# Altium project RK3399_SOM_BOARD.PrjPcb (part 3 of 4)

## Sheet USB_TYPEC_Connector.SchDoc
size A3; Date: 07.08.2025; CheckedBy: Own Check; CompanyName: No Company; DocumentNumber: ELK.PCB.0005.0005.A.A; Revision: V0.0.1; SheetNumber: 16; SheetTotal: 22
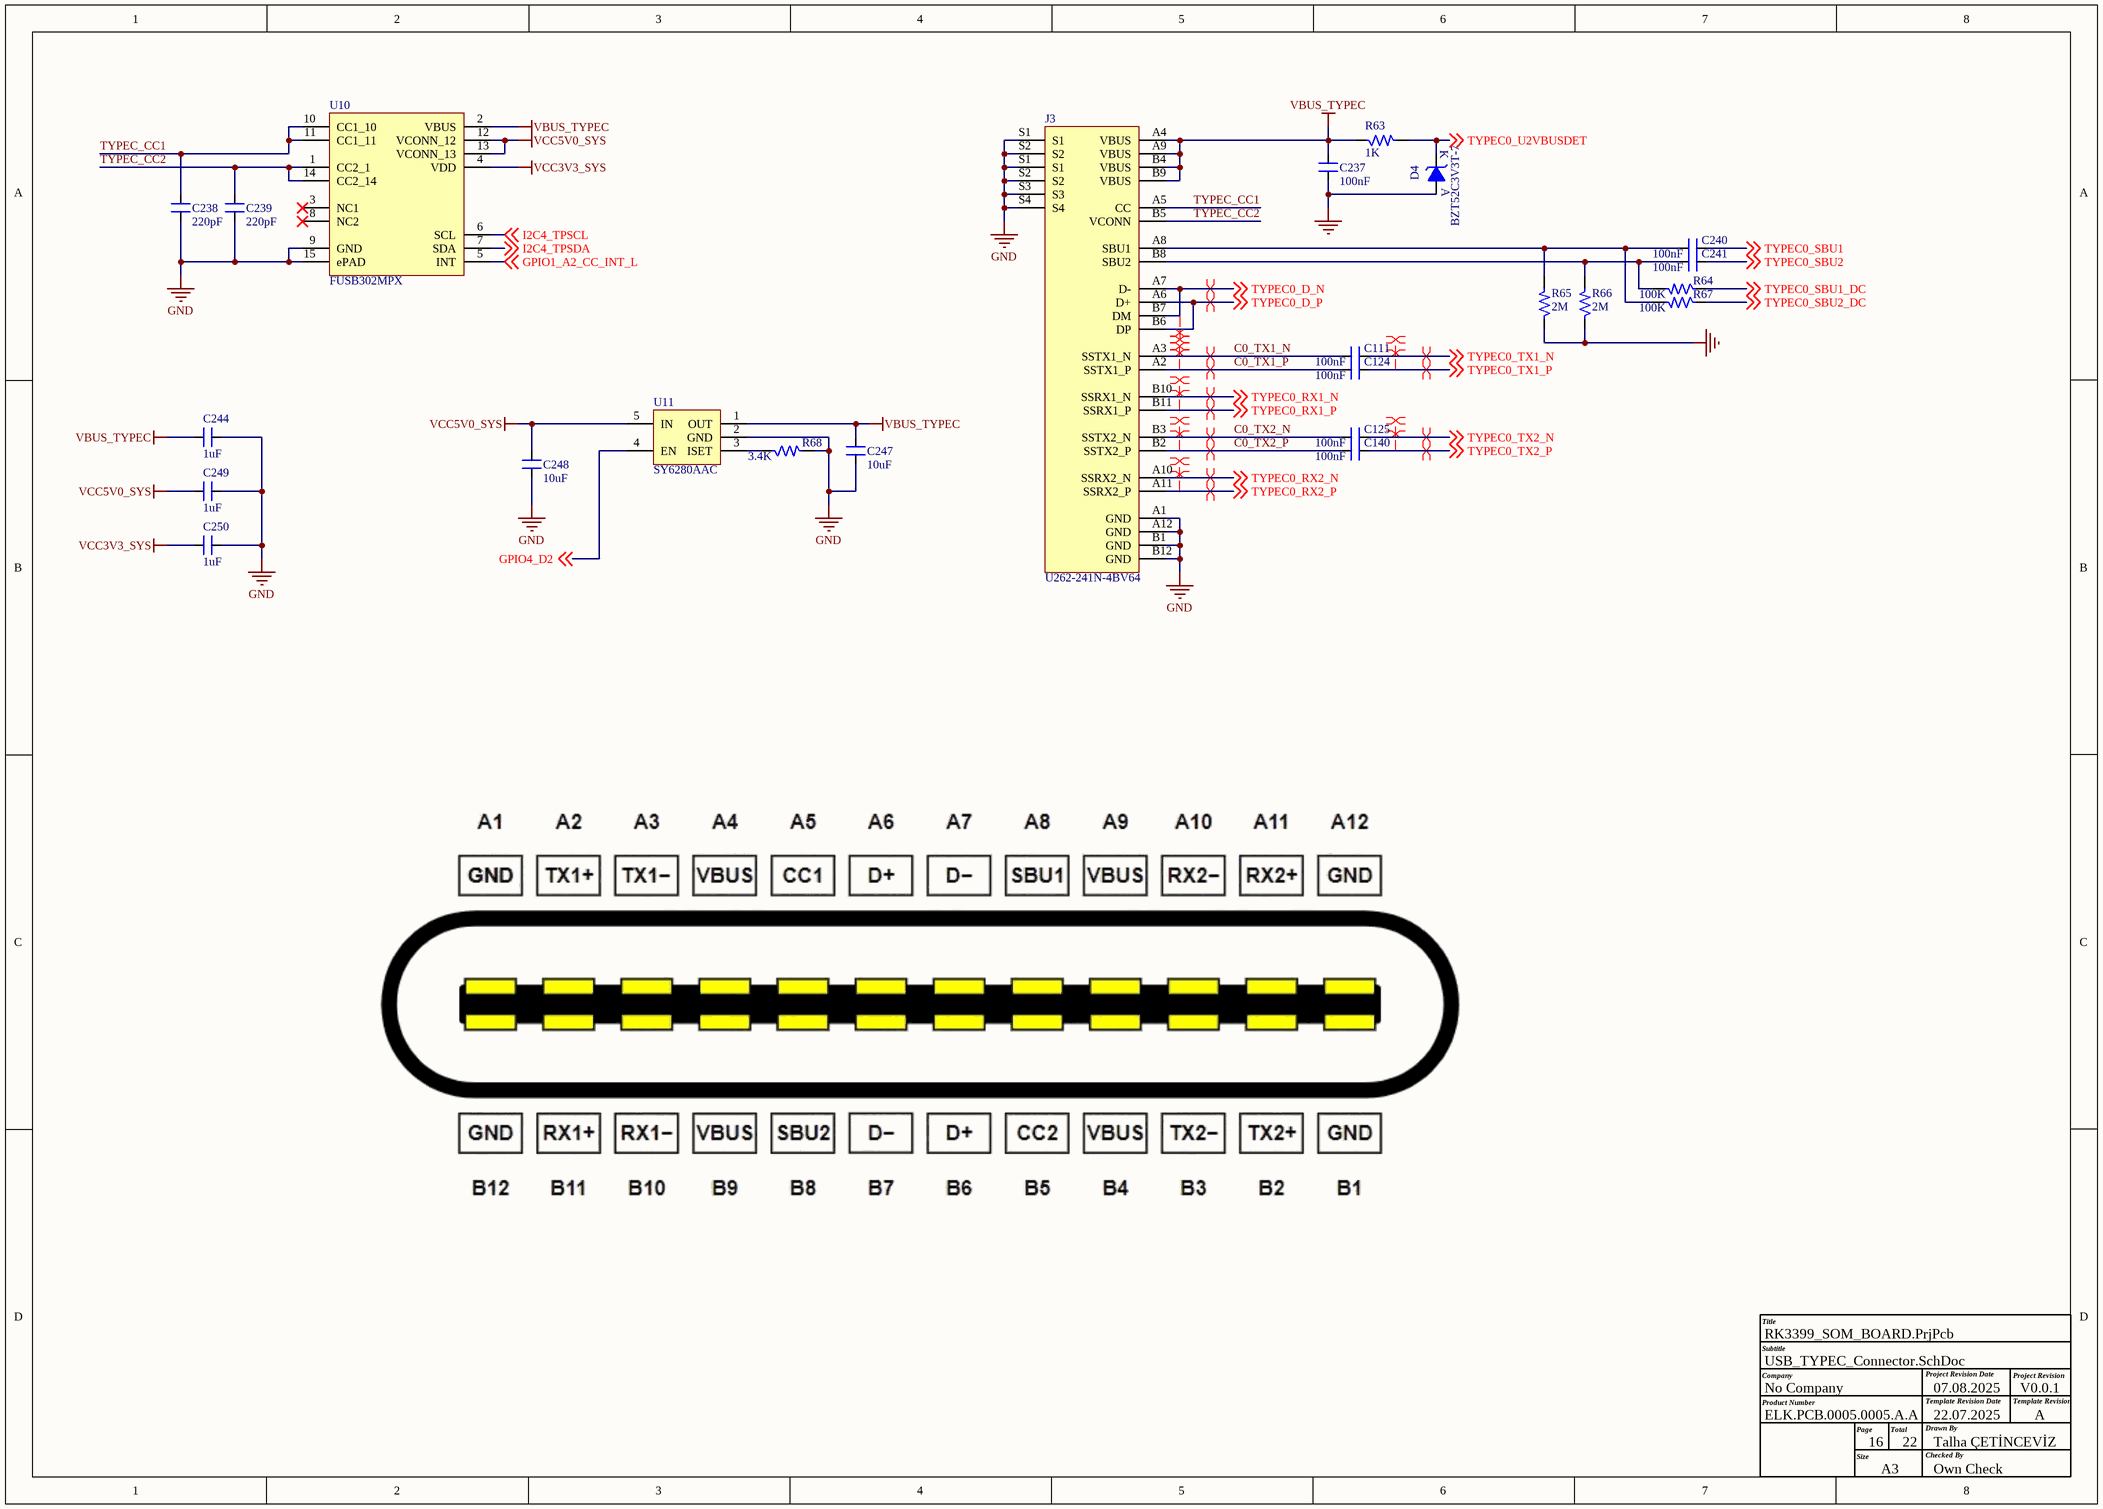
[diagram p14: USB_TYPEC_Connector.SchDoc]

### Parts
(Parts that share a designator on the sheet are numbered #1, #2 ... from top to bottom, then left to right.)
C111#2  100nF  [CAP_0402]
C124#2  100nF  [CAP_0402]
C125#2  100nF  [CAP_0402]
C140#2  100nF  [CAP_0402]
C237  100nF  [CAP_0603]
C238  220pF  [CAP_0402]
C239  220pF  [CAP_0402]
C240  100nF  [CAP_0402]
C241  100nF  [CAP_0402]
C244  1uF  [CAP_0402]
C247  10uF  [CAP_0402]
C248  10uF  [CAP_0402]
C249  1uF  [CAP_0402]
C250  1uF  [CAP_0402]
D4  BZT52C3V3T-7  [DIO_SOD523]
J3  U262-241N-4BV64  [CON24_19.64_U262-241N-4BV64_TH_RA]
R63  1K  [RES_0402]
R64  100K  [RES_0402]
R65  2M  [RES_0402]
R66  2M  [RES_0402]
R67  100K  [RES_0402]
R68  3.4K  [RES_0402]
U10  FUSB302MPX  [MLP-14_98.4X98.4_SMD]
U11  SY6280AAC  [SOT23-5]

### Nets
GND: C237.1 C238.1 C239.1 C244.1 C247.1 C248.1 C249.1 C250.1 D4.A J3.A1(GND) J3.A12(GND) J3.B1(GND) J3.B12(GND) J3.S1 J3.S2 J3.S3 J3.S4 R65.1 R66.1 R68.2 U10.9(GND) U10.15(ePAD) U11.2(GND)
VBUS_TYPEC: C237.2 C244.2 C247.2 J3.A4(VBUS) J3.A9(VBUS) J3.B4(VBUS) J3.B9(VBUS) R63.1 U10.2(VBUS) U11.1(OUT)
VCC3V3_SYS: C250.2 U10.4(VDD)
VCC5V0_SYS: C248.2 C249.2 U10.12(VCONN_12) U10.13(VCONN_13) U11.5(IN)
C0_TX1_N: C111#2.1 J3.A3(SSTX1_N)
C0_TX1_P: C124#2.1 J3.A2(SSTX1_P)
C0_TX2_N: C125#2.1 J3.B3(SSTX2_N)
C0_TX2_P: C140#2.1 J3.B2(SSTX2_P)
GPIO1_A2_CC_INT_L: U10.5(INT) ; off-sheet GPIO1_A2_CC_INT_L
GPIO4_D2: U11.4(EN) ; off-sheet GPIO4_D2
I2C4_TPSCL: U10.6(SCL) ; off-sheet I2C4_TPSCL
I2C4_TPSDA: U10.7(SDA) ; off-sheet I2C4_TPSDA
TYPEC0_D_N: J3.A7(D-) J3.B7(DM) ; off-sheet TYPEC0_D_N
TYPEC0_D_P: J3.A6(D+) J3.B6(DP) ; off-sheet TYPEC0_D_P
TYPEC0_RX1_N: J3.B10(SSRX1_N) ; off-sheet TYPEC0_RX1_N
TYPEC0_RX1_P: J3.B11(SSRX1_P) ; off-sheet TYPEC0_RX1_P
TYPEC0_RX2_N: J3.A10(SSRX2_N) ; off-sheet TYPEC0_RX2_N
TYPEC0_RX2_P: J3.A11(SSRX2_P) ; off-sheet TYPEC0_RX2_P
TYPEC0_SBU1: C240.2 ; off-sheet TYPEC0_SBU1
TYPEC0_SBU1_DC: R64.1 ; off-sheet TYPEC0_SBU1_DC
TYPEC0_SBU2: C241.2 ; off-sheet TYPEC0_SBU2
TYPEC0_SBU2_DC: R67.1 ; off-sheet TYPEC0_SBU2_DC
TYPEC0_TX1_N: C111#2.2 ; off-sheet TYPEC0_TX1_N
TYPEC0_TX1_P: C124#2.2 ; off-sheet TYPEC0_TX1_P
TYPEC0_TX2_N: C125#2.2 ; off-sheet TYPEC0_TX2_N
TYPEC0_TX2_P: C140#2.2 ; off-sheet TYPEC0_TX2_P
TYPEC0_U2VBUSDET: D4.K R63.2 ; off-sheet TYPEC0_U2VBUSDET
TYPEC_CC1: C238.2 J3.A5(CC) U10.10(CC1_10) U10.11(CC1_11)
TYPEC_CC2: C239.2 J3.B5(VCONN) U10.1(CC2_1) U10.14(CC2_14)
NetC240_1: C240.1 J3.A8(SBU1) R65.2 R67.2
NetC241_1: C241.1 J3.B8(SBU2) R64.2 R66.2
NetR68_1: R68.1 U11.3(ISET)

Not connected (* = marked no-connect by the designer): U10 3(NC1)* 8(NC2)*

### Layout directives
differential pair; differential pair class DIFF90_USBTYPEC: C0_TX1_N, C0_TX1_P, C0_TX2_N, C0_TX2_P, TYPEC0_D_N, TYPEC0_D_P, TYPEC0_RX1_N, TYPEC0_RX1_P, TYPEC0_RX2_N, TYPEC0_RX2_P, TYPEC0_TX1_N, TYPEC0_TX1_P, TYPEC0_TX2_N, TYPEC0_TX2_P
net class TYPEC0 SIG. GROUP; net class DIFF_PAIR_CLASS: C0_TX1_N, C0_TX1_P, C0_TX2_N, C0_TX2_P, TYPEC0_D_N, TYPEC0_D_P, TYPEC0_RX1_N, TYPEC0_RX1_P, TYPEC0_RX2_N, TYPEC0_RX2_P, TYPEC0_TX1_N, TYPEC0_TX1_P, TYPEC0_TX2_N, TYPEC0_TX2_P

### Notes on the sheet
- Title
- Company
- Product Number
- Subtitle
- Project Revision Date
- Template Revision Date
- Project Revision
- Template Revision
- Size
- Page
- A3
- Total
- Checked By
- Drawn By
- 22.07.2025
- Talha ÇETİNCEVİZ
- A

### Library data of the parts
C111#2 C124#2 C125#2 C140#2 C240 C241 = CAP_100nF-25V-10%-0402: 0.1µF ±10% 25V Ceramic Capacitor X7R 0402 (1005 Metric); Manufacturer: Walsin Technology Corporation; Manufacturer Part Number: 0402B104K250CT; Case/Package: 0402; Supplier-1: Digikey
C237 = CAP_100nF-10V-5%-0603: 0.1µF ±10% 10V Ceramic Capacitor X7R 0603 (1608 Metric); Manufacturer: Yageo; Manufacturer Part Number: CC0603KRX7R6BB104; Case/Package: 0603; Supplier-1: Digikey
C238 C239 = CAP_220pF-10V-10%-0402: 220pF ±10% 10V Ceramic Capacitor X7R 0402 (1005 Metric); Manufacturer: KEMET; Manufacturer Part Number: C0402C221K8RAC7867; Case/Package: 0402; Supplier-1: Digikey
C244 C249 C250 = CAP_1uF-10V-10%-0402: 1µF ±10% 10V Ceramic Capacitor X6S 0402 (1005 Metric); Manufacturer: Murata Electronics; Manufacturer Part Number: GRT155C81A105KE01D; Case/Package: 0402; Supplier-1: Digikey
C247 C248 = CAP_10uF-10V-20%-0402: 10µF ±20% 10V Ceramic Capacitor X5R 0402 (1005 Metric); Manufacturer Part Number: CL05A106MP5NUNC; Manufacturer: Samsung Electro-Mechanics; Case/Package: 0402; Supplier-1: Digikey
D4 = DIO-Z_3.3V-300mW-SOD-523: Zener Diode 3.3V 300mW ±6% Surface Mount SOD-523; Manufacturer: Diodes Incorporated; Manufacturer Part Number: BZT52C3V3T-7; Case/Package: SOD523; Supplier-1: Digikey
J3 = CON-TYPEC_U262-241N-4BV64-SMD: USB - Type C Female 24 SMD USB Connectors RoHS; Manufacturer: XKB Connectivity; Manufacturer Part Number: U262-241N-4BV64; Case/Package: SMD; Supplier-1: LCSC
R63 = RES_1K-0.1W-1%-0402: 1 kOhms ±1% 0.1W, 1/10W Chip Resistor 0402 (1005 Metric) Anti-Sulfur Thin Film; Manufacturer: Vishay Beyschlag/Draloric/BC Components; Manufacturer Part Number: MCS04020C1001FE000; Case/Package: 0402; Supplier-1: Digikey
R64 R67 = RES_100K-0.1W-1%-0402: 100 kOhms ±1% 0.1W, 1/10W Chip Resistor 0402 (1005 Metric) Anti-Sulfur Thin Film; Manufacturer: Vishay Beyschlag/Draloric/BC Components; Manufacturer Part Number: MCS04020C1003FE000; Case/Package: 0402; Supplier-1: Digikey
R65 R66 = RES_2M-0.1W-1%-0402: 2 MOhms ±1% 0.1W, 1/10W Chip Resistor 0402 (1005 Metric) Anti-Sulfur Thin Film; Manufacturer: Vishay Beyschlag/Draloric/BC Components; Manufacturer Part Number: MCS04020C2004FE000; Case/Package: 0402; Supplier-1: Digikey
R68 = RES_3.4K-0.1W-1%-0402: 3.4 kOhms ±1% 0.1W, 1/10W Chip Resistor 0402 (1005 Metric) Automotive AEC-Q200 Thick Film; Manufacturer: Panasonic Electronic Components; Manufacturer Part Number: ERJ-2RKF3401X; Case/Package: 0402; Supplier-1: Digikey
U10 = IC_FUSB302MPX: USB Controller USB 3.1 USB Interface 14-MLP (2.5x2.5); Manufacturer: ON Semiconductor; Manufacturer Part Number: FUSB302MPX; Case/Package: 14-MLP; Supplier-1: Digikey
U11 = REG-ADJ_5.5V-5.5V-1.25A-SOT-23-5: SOT-23-5 PMIC - Power Distribution Switches RoHS; Manufacturer: Silergy Corp; Manufacturer Part Number: SY6280AAC; Case/Package: SOT-23-5; Supplier-1: LCSC

## Sheet RGMII_PHY.SchDoc
size A4; Date: 07.08.2025; CheckedBy: Own Check; CompanyName: No Company; DocumentNumber: ELK.PCB.0005.0005.A.A; Revision: V0.0.1; SheetNumber: 17; SheetTotal: 22
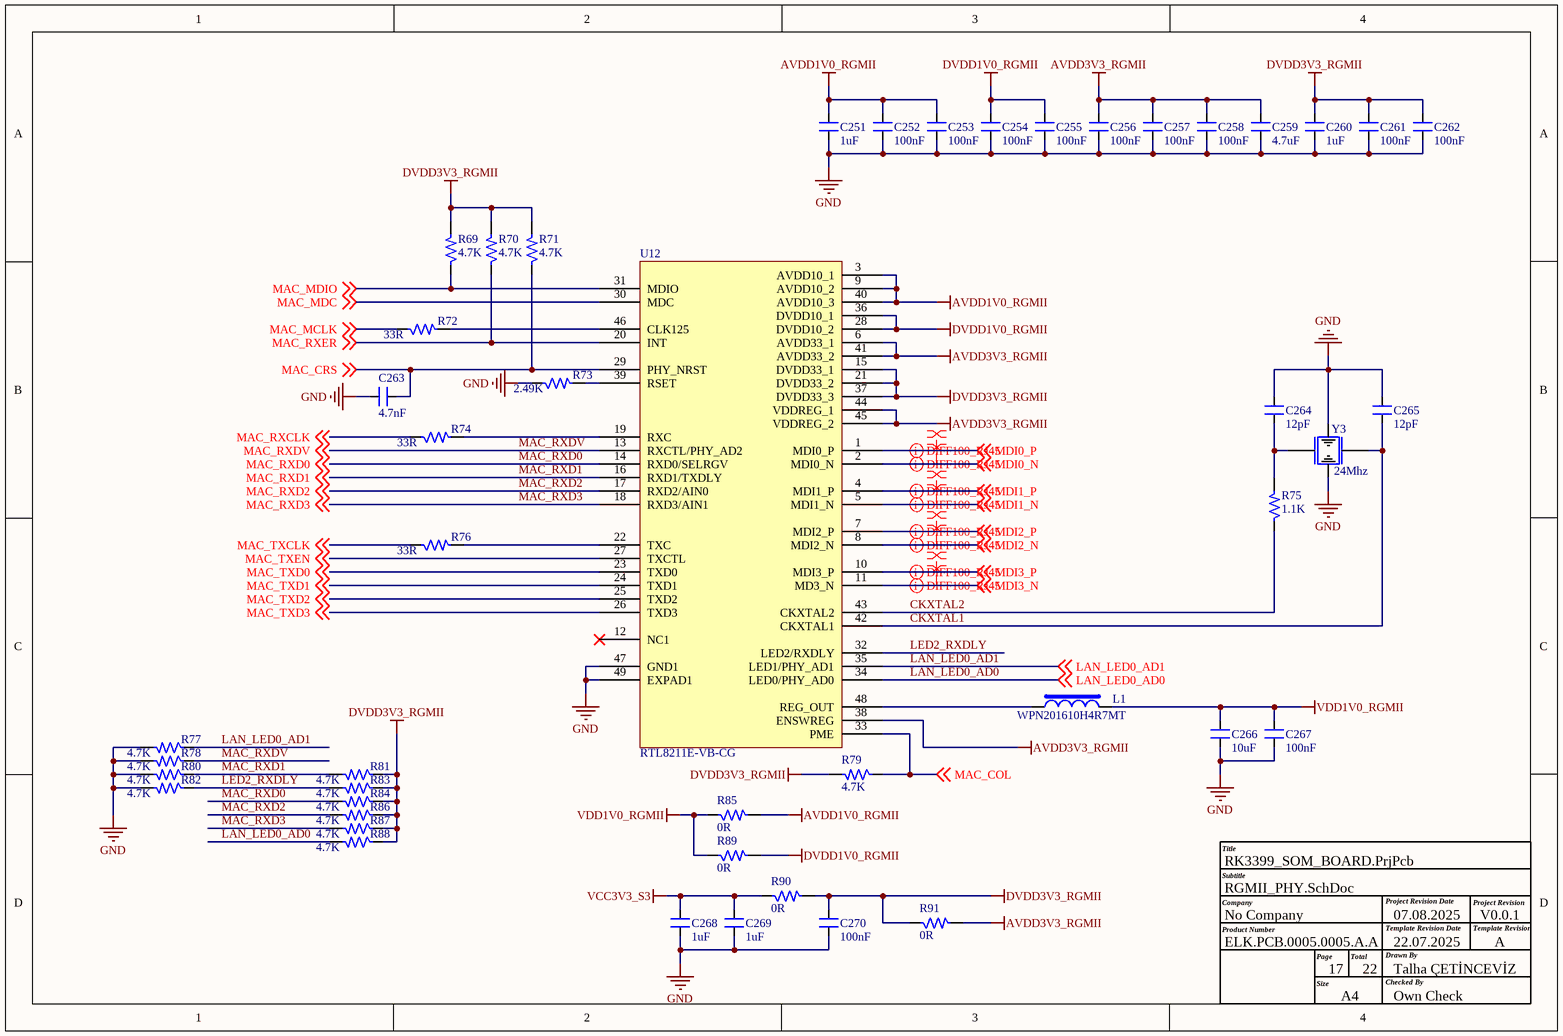
[diagram p15: RGMII_PHY.SchDoc]

### Parts
C251  1uF  [CAP_0201]
C252  100nF  [CAP_0201]
C253  100nF  [CAP_0201]
C254  100nF  [CAP_0201]
C255  100nF  [CAP_0201]
C256  100nF  [CAP_0201]
C257  100nF  [CAP_0201]
C258  100nF  [CAP_0201]
C259  4.7uF  [CAP_0201]
C260  1uF  [CAP_0201]
C261  100nF  [CAP_0201]
C262  100nF  [CAP_0201]
C263  4.7nF  [CAP_0201]
C264  12pF  [CAP_0201]
C265  12pF  [CAP_0201]
C266  10uF  [CAP_0402]
C267  100nF  [CAP_0201]
C268  1uF  [CAP_0201]
C269  1uF  [CAP_0201]
C270  100nF  [CAP_0201]
L1  WPN201610H4R7MT  [IND_62.9_110X86.6_SMD]
R69  4.7K  [RES_0201]
R70  4.7K  [RES_0201]
R71  4.7K  [RES_0201]
R72  33R  [RES_0201]
R73  2.49K  [RES_0201]
R74  33R  [RES_0201]
R75  1.1K  [RES_0201]
R76  33R  [RES_0201]
R77  4.7K  [RES_0201]
R78  4.7K  [RES_0201]
R79  4.7K  [RES_0201]
R80  4.7K  [RES_0201]
R81  4.7K  [RES_0201]
R82  4.7K  [RES_0201]
R83  4.7K  [RES_0201]
R84  4.7K  [RES_0201]
R85  0R  [RES_0201]
R86  4.7K  [RES_0201]
R87  4.7K  [RES_0201]
R88  4.7K  [RES_0201]
R89  0R  [RES_0201]
R90  0R  [RES_0201]
R91  0R  [RES_0201]
U12  RTL8211E-VB-CG  [QFN48_19.6_324X324_SMD]
Y3  24Mhz  [XTAL_ABM8AIG-24.000MHZ-12-2Z-T3]

### Nets
AVDD1V0_RGMII: C251.2 C252.2 C253.2 R85.2 U12.3(AVDD10_1) U12.9(AVDD10_2) U12.40(AVDD10_3)
AVDD3V3_RGMII: C256.2 C257.2 C258.2 C259.2 R91.2 U12.6(AVDD33_1) U12.38(ENSWREG) U12.41(AVDD33_2) U12.44(VDDREG_1) U12.45(VDDREG_2)
DVDD1V0_RGMII: C254.2 C255.2 R89.2 U12.28(DVDD10_2) U12.36(DVDD10_1)
DVDD3V3_RGMII: C260.2 C261.2 C262.2 C270.2 R69.2 R70.2 R71.2 R79.2 R81.1 R83.1 R84.1 R86.1 R87.1 R88.1 R90.2 R91.1 U12.15(DVDD33_1) U12.21(DVDD33_2) U12.37(DVDD33_3)
GND: C251.1 C252.1 C253.1 C254.1 C255.1 C256.1 C257.1 C258.1 C259.1 C260.1 C261.1 C262.1 C263.2 C264.1 C265.1 C266.1 C267.1 C268.1 C269.1 C270.1 R73.1 R77.2 R78.2 R80.2 R82.2 U12.47(GND1) U12.49(EXPAD1) Y3.2 Y3.4
VCC3V3_S3: C268.2 C269.2 R90.1
VDD1V0_RGMII: C266.2 C267.2 L1.2 R85.1 R89.1
CKXTAL1: C265.2 U12.42(CKXTAL1) Y3.1
CKXTAL2: R75.1 U12.43(CKXTAL2)
LAN_LED0_AD0: R88.2 U12.34(LED0/PHY_AD0) ; off-sheet LAN_LED0_AD0
LAN_LED0_AD1: R77.1 U12.35(LED1/PHY_AD1) ; off-sheet LAN_LED0_AD1
LED2_RXDLY: R82.1 R83.2 U12.32(LED2/RXDLY)
MAC_COL: R79.1 U12.33(PME) ; off-sheet MAC_COL
MAC_CRS: C263.1 R71.1 U12.29(PHY_NRST) ; off-sheet MAC_CRS
MAC_MCLK: R72.1 ; off-sheet MAC_MCLK
MAC_MDC: U12.30(MDC) ; off-sheet MAC_MDC
MAC_MDIO: R69.1 U12.31(MDIO) ; off-sheet MAC_MDIO
MAC_RXCLK: R74.1 ; off-sheet MAC_RXCLK
MAC_RXD0: R84.2 U12.14(RXD0/SELRGV) ; off-sheet MAC_RXD0
MAC_RXD1: R80.1 R81.2 U12.16(RXD1/TXDLY) ; off-sheet MAC_RXD1
MAC_RXD2: R86.2 U12.17(RXD2/AIN0) ; off-sheet MAC_RXD2
MAC_RXD3: R87.2 U12.18(RXD3/AIN1) ; off-sheet MAC_RXD3
MAC_RXDV: R78.1 U12.13(RXCTL/PHY_AD2) ; off-sheet MAC_RXDV
MAC_RXER: R70.1 U12.20(INT) ; off-sheet MAC_RXER
MAC_TXCLK: R76.1 ; off-sheet MAC_TXCLK
MAC_TXD0: U12.23(TXD0) ; off-sheet MAC_TXD0
MAC_TXD1: U12.24(TXD1) ; off-sheet MAC_TXD1
MAC_TXD2: U12.25(TXD2) ; off-sheet MAC_TXD2
MAC_TXD3: U12.26(TXD3) ; off-sheet MAC_TXD3
MAC_TXEN: U12.27(TXCTL) ; off-sheet MAC_TXEN
MDI0_N: U12.2(MDI0_N) ; off-sheet MDI0_N
MDI0_P: U12.1(MDI0_P) ; off-sheet MDI0_P
MDI1_N: U12.5(MDI1_N) ; off-sheet MDI1_N
MDI1_P: U12.4(MDI1_P) ; off-sheet MDI1_P
MDI2_N: U12.8(MDI2_N) ; off-sheet MDI2_N
MDI2_P: U12.7(MDI2_P) ; off-sheet MDI2_P
MDI3_N: U12.11(MD3_N) ; off-sheet MDI3_N
MDI3_P: U12.10(MDI3_P) ; off-sheet MDI3_P
NetC264_2: C264.2 R75.2 Y3.3
NetL1_1: L1.1 U12.48(REG_OUT)
NetR72_2: R72.2 U12.46(CLK125)
NetR73_2: R73.2 U12.39(RSET)
NetR74_2: R74.2 U12.19(RXC)
NetR76_2: R76.2 U12.22(TXC)

Not connected (* = marked no-connect by the designer): U12 12(NC1)*

### Layout directives
differential pair; differential pair class DIFF100_RJ45: MDI0_N, MDI0_P, MDI1_N, MDI1_P, MDI2_N, MDI2_P, MDI3_N, MDI3_P
net class LAN SIG. GROUP; net class DIFF_PAIR_CLASS: MDI0_N, MDI0_P, MDI1_N, MDI1_P, MDI2_N, MDI2_P, MDI3_N, MDI3_P

### Notes on the sheet
- Title
- Company
- Product Number
- Subtitle
- Project Revision Date
- Template Revision Date
- Project Revision
- Template Revision
- Size
- Page
- A4
- Total
- Checked By
- Drawn By
- 22.07.2025
- Talha ÇETİNCEVİZ
- A

### Library data of the parts
C251 C260 C268 C269 = CAP_1uF-16V-10%-0201: 1µF ±20% 16V Ceramic Capacitor X5R 0201 (0603 Metric); Manufacturer: Samsung Electro-Mechanics; Manufacturer Part Number: CL03A105MO3NRNH; Case/Package: 0201; Supplier-1: Digikey
C252-C258 C261 C262 C267 C270 = CAP_100nF-25V-10%-0201: 0.1µF ±10% 25V Ceramic Capacitor X5R 0201 (0603 Metric); Manufacturer: TDK Corporation; Manufacturer Part Number: C0603X5R1E104K030BB; Case/Package: 0201; Supplier-1: Digikey
C259 = CAP_4.7uF-6.3V-20%-0201: 4.7µF ±20% 6.3V Ceramic Capacitor X5R 0201 (0603 Metric); Manufacturer: Murata Electronics; Manufacturer Part Number: GRM035R60J475ME15D; Case/Package: 0201; Supplier-1: Digikey
C263 = CAP_4.7nF-10V-10%-0201: 4700pF ±10% 10V Ceramic Capacitor X7R 0201 (0603 Metric); Manufacturer: AVX Corporation; Manufacturer Part Number: 0201ZC472KAT2A; Case/Package: 0201; Supplier-1: Digikey
C264 C265 = CAP_12pF-16V-10%-0201: 12pF ±10% 16V Ceramic Capacitor C0G, NP0 0201 (0603 Metric); Manufacturer: AVX Corporation; Manufacturer Part Number: 0201YA120KAT2A; Case/Package: 0201; Supplier-1: Digikey
C266 = CAP_10uF-10V-20%-0402: as C247 on sheet USB_TYPEC_Connector; Case/Package: 0402; Supplier-1: Digikey
L1 = IND_4.7uH-0.9A-20%-SMD: 4.7uH ±20% 900mA 425mΩ SMD,2.0x1.6x1.0mm Power Inductors RoHS; Manufacturer: Sunlord; Manufacturer Part Number: WPN201610H4R7MT; Case/Package: SMD; Supplier-1: LCSC
R69-R71 R77-R84 R86-R88 = RES_4.7K-0.1W-1%-0201: 4.02 kOhms ±1% 0.05W, 1/20W Chip Resistor 0201 (0603 Metric) Thick Film; Manufacturer: Yageo; Manufacturer Part Number: RC0201FR-074K02L; Case/Package: 0201; Supplier-1: Digikey
R72 R74 R76 = RES_33R-0.05W-1%-0201: 33 Ohms ±1% 0.05W, 1/20W Chip Resistor 0201 (0603 Metric) Thick Film; Manufacturer: Yageo; Manufacturer Part Number: RC0201FR-0733RL; Case/Package: 0201; Supplier-1: Digikey
R73 = RES_2.49K-0.05W-1%-0201: 2.49 kOhms ±1% 0.05W, 1/20W Chip Resistor 0201 (0603 Metric) Automotive AEC-Q200 Thick Film; Manufacturer: Panasonic Electronic Components; Manufacturer Part Number: ERJ-1GNF2491C; Case/Package: 0201; Supplier-1: Digikey
R75 = RES_1.1K-0.05W-1%-0201: 1.1 kOhms ±1% 0.05W, 1/20W Chip Resistor 0201 (0603 Metric) Automotive AEC-Q200 Thick Film; Manufacturer: Panasonic Electronic Components; Manufacturer Part Number: ERJ-1GNF1101C; Case/Package: 0201; Supplier-1: Digikey
R85 R89-R91 = RES_0R-0.05W-1%-0201: 0 Ohms Jumper 0.05W, 1/20W Chip Resistor 0201 (0603 Metric) Automotive AEC-Q200 Thick Film; Manufacturer: Bourns Inc.; Manufacturer Part Number: CR0201AJ/-000GLF; Case/Package: 0201; Supplier-1: Digikey
U12 = IC_RTL8211E-VB-CG: Ethernet Transceivers 10/100/1000 Base-T PHY GMII, MII, RGMII 1.43V ~ 3.63V QFN-48_6x6x04P Ethernet ICs RoHS; Manufacturer: Realtek Semicon; Manufacturer Part Number: RTL8211E-VB-CG; Case/Package: QFN-48; Supplier-1: LCSC
Y3 = XTAL_24Mhz-12pF-4-SMD: 24MHz ±20ppm Crystal 12pF 50 Ohms 4-SMD, No Lead; Manufacturer: Abracon LLC; Manufacturer Part Number: ABM8AIG-24.000MHZ-12-2Z-T3; Case/Package: SMD; Supplier-1: Digikey

## Sheet PushButton_SYS-LED.SchDoc
size A4; Date: 07.08.2025; CheckedBy: Own Check; CompanyName: No Company; DocumentNumber: ELK.PCB.0005.0005.A.A; Revision: V0.0.1; SheetNumber: 18; SheetTotal: 22
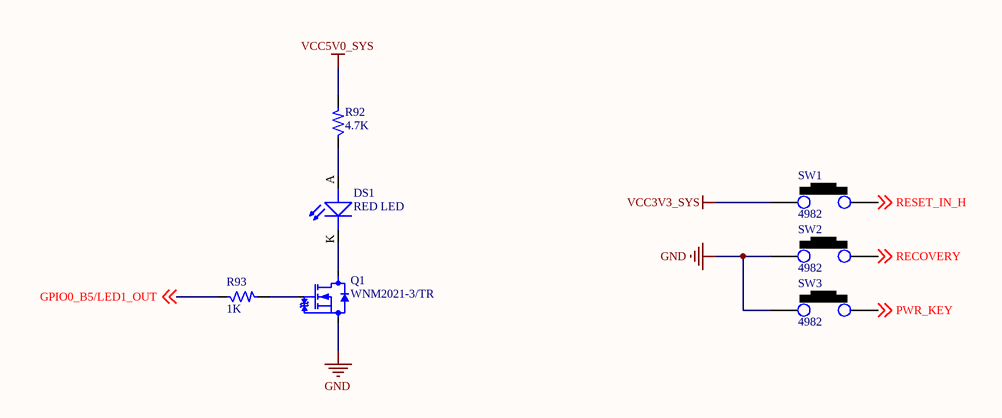
[diagram p16: PushButton_SYS-LED.SchDoc]

### Parts
DS1  RED LED  [LED_0805]
Q1  WNM2021-3/TR  [SOT-323-3]
R92  4.7K  [RES_0402]
R93  1K  [RES_0402]
SW1  4982  [SW_177_39.3X77.7_SMD]
SW2  4982  [SW_177_39.3X77.7_SMD]
SW3  4982  [SW_177_39.3X77.7_SMD]

### Nets
GND: Q1.2(S) SW2.1 SW3.1
VCC3V3_SYS: SW1.1
VCC5V0_SYS: R92.2
GPIO0_B5/LED1_OUT: R93.1 ; off-sheet GPIO0_B5/LED1_OUT
PWR_KEY: SW3.2 ; off-sheet PWR_KEY
RECOVERY: SW2.2 ; off-sheet RECOVERY
RESET_IN_H: SW1.2 ; off-sheet RESET_IN_H
NetDS1_A: DS1.A(ANODE) R92.1
NetDS1_K: DS1.K(CATHODE) Q1.3(D)
NetQ1_1: Q1.1(G) R93.2

### Notes on the sheet
- Title
- Company
- Product Number
- Subtitle
- Project Revision Date
- Template Revision Date
- Project Revision
- Template Revision
- Size
- Page
- A4
- Total
- Checked By
- Drawn By
- 22.07.2025
- Talha ÇETİNCEVİZ
- A

### Library data of the parts
DS1 = LED_RED-2V-20mA-0805: Red 631nm LED Indication - Discrete 2V 0805 (2012 Metric); Manufacturer: Vishay Lite-On; Manufacturer Part Number: LTST-C171KRKT; Case/Package: 0805; Supplier-1: SP ROAD
Q1 = MOSFET-N_20V-820mA-SOT-323: N Channel 20V 820mA 850mV @ 250uA 310mΩ @ 550mA,4.5V 310mW SOT-323(SC-70) MOSFET RoHS; Manufacturer: WILLSEMI(Will Semicon); Manufacturer Part Number: WNM2021-3/TR; Case/Package: SOT-323(SC-70); Supplier-1: LCSC
R92 = RES_4.7K-0.1W-1%-0402: 4.7 kOhms ±1% 0.1W, 1/10W Chip Resistor 0402 (1005 Metric) Automotive AEC-Q200 Thick Film; Manufacturer: Panasonic Electronic Components; Manufacturer Part Number: ERJ-2RKF4701X; Case/Package: 0402; Supplier-1: Digikey
R93 = RES_1K-0.1W-1%-0402: as R63 on sheet USB_TYPEC_Connector; Case/Package: 0402; Supplier-1: Digikey
SW1-SW3 = SW1_4982: Tactile Switch 3x4x2mm SMD 2-Pin; Manufacturer: NA; Manufacturer Part Number: NA; Case/Package: SMD; Supplier-1: Sunrom

## Sheet DDR4_260PIN_Connector.SchDoc
size A3; Date: 07.08.2025; CheckedBy: Own Check; CompanyName: No Company; DocumentNumber: ELK.PCB.0005.0005.A.A; Revision: V0.0.1; SheetNumber: 19; SheetTotal: 22
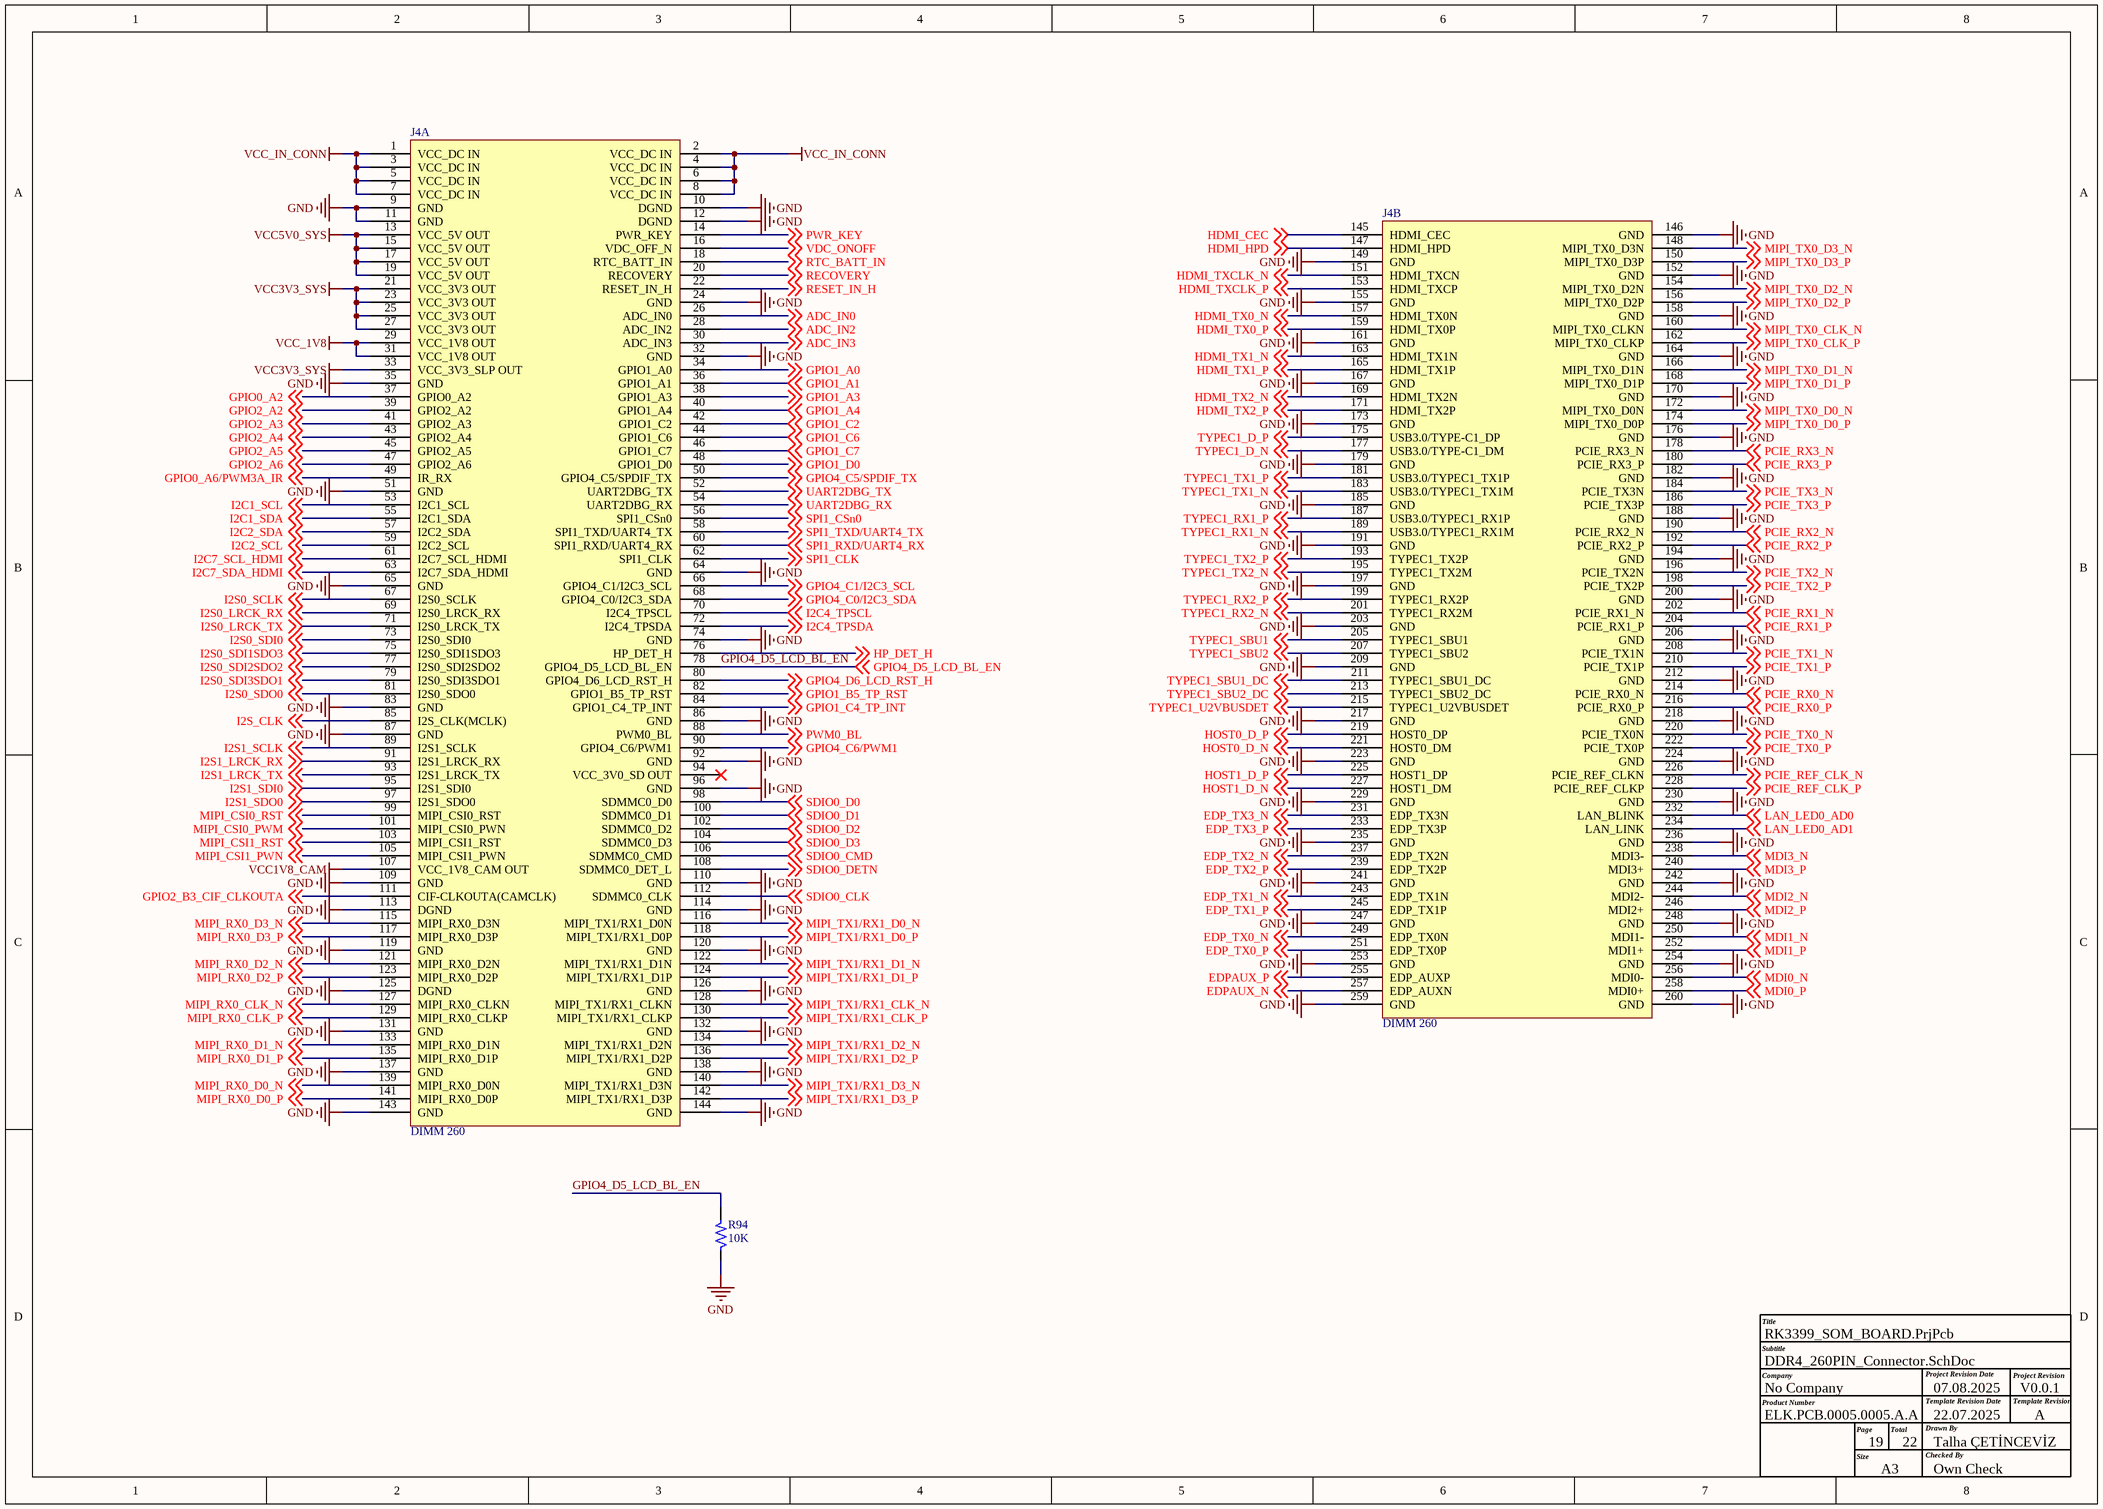
[diagram p17: DDR4_260PIN_Connector.SchDoc]

### Parts
J4  DIMM 260  [DIMM260_DDR4]  (parts A,B of 2)
R94  10K  [RES_0402]

### Nets
GND: J4.9(GND) J4.10(DGND) J4.11(GND) J4.12(DGND) J4.24(GND) J4.32(GND) J4.35(GND) J4.51(GND) J4.64(GND) J4.65(GND) J4.74(GND) J4.83(GND) J4.86(GND) J4.87(GND) J4.92(GND) J4.96(GND) J4.109(GND) J4.110(GND) J4.113(DGND) J4.114(GND) J4.119(GND) J4.120(GND) J4.125(DGND) J4.126(GND) J4.131(GND) J4.132(GND) J4.137(GND) J4.138(GND) J4.143(GND) J4.144(GND) J4.146(GND) J4.149(GND) J4.152(GND) J4.155(GND) J4.158(GND) J4.161(GND) J4.164(GND) J4.167(GND) J4.170(GND) J4.173(GND) J4.176(GND) J4.179(GND) J4.182(GND) J4.185(GND) J4.188(GND) J4.191(GND) J4.194(GND) J4.197(GND) J4.200(GND) J4.203(GND) J4.206(GND) J4.209(GND) J4.212(GND) J4.217(GND) J4.218(GND) J4.223(GND) J4.224(GND) J4.229(GND) J4.230(GND) J4.235(GND) J4.236(GND) J4.241(GND) J4.242(GND) J4.247(GND) J4.248(GND) J4.253(GND) J4.254(GND) J4.259(GND) J4.260(GND) R94.1
VCC1V8_CAM: J4.107(VCC_1V8_CAM_OUT)
VCC3V3_SYS: J4.21(VCC_3V3_OUT) J4.23(VCC_3V3_OUT) J4.25(VCC_3V3_OUT) J4.27(VCC_3V3_OUT) J4.33(VCC_3V3_SLP_OUT)
VCC5V0_SYS: J4.13(VCC_5V_OUT) J4.15(VCC_5V_OUT) J4.17(VCC_5V_OUT) J4.19(VCC_5V_OUT)
VCC_1V8: J4.29(VCC_1V8_OUT) J4.31(VCC_1V8_OUT)
VCC_IN_CONN: J4.1(VCC_DC_IN) J4.2(VCC_DC_IN) J4.3(VCC_DC_IN) J4.4(VCC_DC_IN) J4.5(VCC_DC_IN) J4.6(VCC_DC_IN) J4.7(VCC_DC_IN) J4.8(VCC_DC_IN)
ADC_IN0: J4.26(ADC_IN0) ; off-sheet ADC_IN0
ADC_IN2: J4.28(ADC_IN2) ; off-sheet ADC_IN2
ADC_IN3: J4.30(ADC_IN3) ; off-sheet ADC_IN3
EDP_TX0_N: J4.249(EDP_TX0N) ; off-sheet EDP_TX0_N
EDP_TX0_P: J4.251(EDP_TX0P) ; off-sheet EDP_TX0_P
EDP_TX1_N: J4.243(EDP_TX1N) ; off-sheet EDP_TX1_N
EDP_TX1_P: J4.245(EDP_TX1P) ; off-sheet EDP_TX1_P
EDP_TX2_N: J4.237(EDP_TX2N) ; off-sheet EDP_TX2_N
EDP_TX2_P: J4.239(EDP_TX2P) ; off-sheet EDP_TX2_P
EDP_TX3_N: J4.231(EDP_TX3N) ; off-sheet EDP_TX3_N
EDP_TX3_P: J4.233(EDP_TX3P) ; off-sheet EDP_TX3_P
EDPAUX_N: J4.257(EDP_AUXN) ; off-sheet EDPAUX_N
EDPAUX_P: J4.255(EDP_AUXP) ; off-sheet EDPAUX_P
GPIO0_A2: J4.37(GPIO0_A2) ; off-sheet GPIO0_A2
GPIO0_A6/PWM3A_IR: J4.49(IR_RX) ; off-sheet GPIO0_A6/PWM3A_IR
GPIO1_A0: J4.34(GPIO1_A0) ; off-sheet GPIO1_A0
GPIO1_A1: J4.36(GPIO1_A1) ; off-sheet GPIO1_A1
GPIO1_A3: J4.38(GPIO1_A3) ; off-sheet GPIO1_A3
GPIO1_A4: J4.40(GPIO1_A4) ; off-sheet GPIO1_A4
GPIO1_B5_TP_RST: J4.82(GPIO1_B5_TP_RST) ; off-sheet GPIO1_B5_TP_RST
GPIO1_C2: J4.42(GPIO1_C2) ; off-sheet GPIO1_C2
GPIO1_C4_TP_INT: J4.84(GPIO1_C4_TP_INT) ; off-sheet GPIO1_C4_TP_INT
GPIO1_C6: J4.44(GPIO1_C6) ; off-sheet GPIO1_C6
GPIO1_C7: J4.46(GPIO1_C7) ; off-sheet GPIO1_C7
GPIO1_D0: J4.48(GPIO1_D0) ; off-sheet GPIO1_D0
GPIO2_A2: J4.39(GPIO2_A2) ; off-sheet GPIO2_A2
GPIO2_A3: J4.41(GPIO2_A3) ; off-sheet GPIO2_A3
GPIO2_A4: J4.43(GPIO2_A4) ; off-sheet GPIO2_A4
GPIO2_A5: J4.45(GPIO2_A5) ; off-sheet GPIO2_A5
GPIO2_A6: J4.47(GPIO2_A6) ; off-sheet GPIO2_A6
GPIO2_B3_CIF_CLKOUTA: J4.111(CIF-CLKOUTA(CAMCLK)) ; off-sheet GPIO2_B3_CIF_CLKOUTA
GPIO4_C0/I2C3_SDA: J4.68(GPIO4_C0/I2C3_SDA) ; off-sheet GPIO4_C0/I2C3_SDA
GPIO4_C1/I2C3_SCL: J4.66(GPIO4_C1/I2C3_SCL) ; off-sheet GPIO4_C1/I2C3_SCL
GPIO4_C5/SPDIF_TX: J4.50(GPIO4_C5/SPDIF_TX) ; off-sheet GPIO4_C5/SPDIF_TX
GPIO4_C6/PWM1: J4.90(GPIO4_C6/PWM1) ; off-sheet GPIO4_C6/PWM1
GPIO4_D5_LCD_BL_EN: J4.78(GPIO4_D5_LCD_BL_EN) R94.2 ; off-sheet GPIO4_D5_LCD_BL_EN
GPIO4_D6_LCD_RST_H: J4.80(GPIO4_D6_LCD_RST_H) ; off-sheet GPIO4_D6_LCD_RST_H
HDMI_CEC: J4.145(HDMI_CEC) ; off-sheet HDMI_CEC
HDMI_HPD: J4.147(HDMI_HPD) ; off-sheet HDMI_HPD
HDMI_TX0_N: J4.157(HDMI_TX0N) ; off-sheet HDMI_TX0_N
HDMI_TX0_P: J4.159(HDMI_TX0P) ; off-sheet HDMI_TX0_P
HDMI_TX1_N: J4.163(HDMI_TX1N) ; off-sheet HDMI_TX1_N
HDMI_TX1_P: J4.165(HDMI_TX1P) ; off-sheet HDMI_TX1_P
HDMI_TX2_N: J4.169(HDMI_TX2N) ; off-sheet HDMI_TX2_N
HDMI_TX2_P: J4.171(HDMI_TX2P) ; off-sheet HDMI_TX2_P
HDMI_TXCLK_N: J4.151(HDMI_TXCN) ; off-sheet HDMI_TXCLK_N
HDMI_TXCLK_P: J4.153(HDMI_TXCP) ; off-sheet HDMI_TXCLK_P
HOST0_D_N: J4.221(HOST0_DM) ; off-sheet HOST0_D_N
HOST0_D_P: J4.219(HOST0_DP) ; off-sheet HOST0_D_P
HOST1_D_N: J4.227(HOST1_DM) ; off-sheet HOST1_D_N
HOST1_D_P: J4.225(HOST1_DP) ; off-sheet HOST1_D_P
HP_DET_H: J4.76(HP_DET_H) ; off-sheet HP_DET_H
I2C1_SCL: J4.53(I2C1_SCL) ; off-sheet I2C1_SCL
I2C1_SDA: J4.55(I2C1_SDA) ; off-sheet I2C1_SDA
I2C2_SCL: J4.59(I2C2_SCL) ; off-sheet I2C2_SCL
I2C2_SDA: J4.57(I2C2_SDA) ; off-sheet I2C2_SDA
I2C4_TPSCL: J4.70(I2C4_TPSCL) ; off-sheet I2C4_TPSCL
I2C4_TPSDA: J4.72(I2C4_TPSDA) ; off-sheet I2C4_TPSDA
I2C7_SCL_HDMI: J4.61(I2C7_SCL_HDMI) ; off-sheet I2C7_SCL_HDMI
I2C7_SDA_HDMI: J4.63(I2C7_SDA_HDMI) ; off-sheet I2C7_SDA_HDMI
I2S0_LRCK_RX: J4.69(I2S0_LRCK_RX) ; off-sheet I2S0_LRCK_RX
I2S0_LRCK_TX: J4.71(I2S0_LRCK_TX) ; off-sheet I2S0_LRCK_TX
I2S0_SCLK: J4.67(I2S0_SCLK) ; off-sheet I2S0_SCLK
I2S0_SDI0: J4.73(I2S0_SDI0) ; off-sheet I2S0_SDI0
I2S0_SDI1SDO3: J4.75(I2S0_SDI1SDO3) ; off-sheet I2S0_SDI1SDO3
I2S0_SDI2SDO2: J4.77(I2S0_SDI2SDO2) ; off-sheet I2S0_SDI2SDO2
I2S0_SDI3SDO1: J4.79(I2S0_SDI3SDO1) ; off-sheet I2S0_SDI3SDO1
I2S0_SDO0: J4.81(I2S0_SDO0) ; off-sheet I2S0_SDO0
I2S1_LRCK_RX: J4.91(I2S1_LRCK_RX) ; off-sheet I2S1_LRCK_RX
I2S1_LRCK_TX: J4.93(I2S1_LRCK_TX) ; off-sheet I2S1_LRCK_TX
I2S1_SCLK: J4.89(I2S1_SCLK) ; off-sheet I2S1_SCLK
I2S1_SDI0: J4.95(I2S1_SDI0) ; off-sheet I2S1_SDI0
I2S1_SDO0: J4.97(I2S1_SDO0) ; off-sheet I2S1_SDO0
I2S_CLK: J4.85(I2S_CLK(MCLK)) ; off-sheet I2S_CLK
LAN_LED0_AD0: J4.232(LAN_BLINK) ; off-sheet LAN_LED0_AD0
LAN_LED0_AD1: J4.234(LAN_LINK) ; off-sheet LAN_LED0_AD1
MDI0_N: J4.256(MDI0-) ; off-sheet MDI0_N
MDI0_P: J4.258(MDI0+) ; off-sheet MDI0_P
MDI1_N: J4.250(MDI1-) ; off-sheet MDI1_N
MDI1_P: J4.252(MDI1+) ; off-sheet MDI1_P
MDI2_N: J4.244(MDI2-) ; off-sheet MDI2_N
MDI2_P: J4.246(MDI2+) ; off-sheet MDI2_P
MDI3_N: J4.238(MDI3-) ; off-sheet MDI3_N
MDI3_P: J4.240(MDI3+) ; off-sheet MDI3_P
MIPI_CSI0_PWM: J4.101(MIPI_CSI0_PWN) ; off-sheet MIPI_CSI0_PWM
MIPI_CSI0_RST: J4.99(MIPI_CSI0_RST) ; off-sheet MIPI_CSI0_RST
MIPI_CSI1_PWN: J4.105(MIPI_CSI1_PWN) ; off-sheet MIPI_CSI1_PWN
MIPI_CSI1_RST: J4.103(MIPI_CSI1_RST) ; off-sheet MIPI_CSI1_RST
MIPI_RX0_CLK_N: J4.127(MIPI_RX0_CLKN) ; off-sheet MIPI_RX0_CLK_N
MIPI_RX0_CLK_P: J4.129(MIPI_RX0_CLKP) ; off-sheet MIPI_RX0_CLK_P
MIPI_RX0_D0_N: J4.139(MIPI_RX0_D0N) ; off-sheet MIPI_RX0_D0_N
MIPI_RX0_D0_P: J4.141(MIPI_RX0_D0P) ; off-sheet MIPI_RX0_D0_P
MIPI_RX0_D1_N: J4.133(MIPI_RX0_D1N) ; off-sheet MIPI_RX0_D1_N
MIPI_RX0_D1_P: J4.135(MIPI_RX0_D1P) ; off-sheet MIPI_RX0_D1_P
MIPI_RX0_D2_N: J4.121(MIPI_RX0_D2N) ; off-sheet MIPI_RX0_D2_N
MIPI_RX0_D2_P: J4.123(MIPI_RX0_D2P) ; off-sheet MIPI_RX0_D2_P
MIPI_RX0_D3_N: J4.115(MIPI_RX0_D3N) ; off-sheet MIPI_RX0_D3_N
MIPI_RX0_D3_P: J4.117(MIPI_RX0_D3P) ; off-sheet MIPI_RX0_D3_P
MIPI_TX0_CLK_N: J4.160(MIPI_TX0_CLKN) ; off-sheet MIPI_TX0_CLK_N
MIPI_TX0_CLK_P: J4.162(MIPI_TX0_CLKP) ; off-sheet MIPI_TX0_CLK_P
MIPI_TX0_D0_N: J4.172(MIPI_TX0_D0N) ; off-sheet MIPI_TX0_D0_N
MIPI_TX0_D0_P: J4.174(MIPI_TX0_D0P) ; off-sheet MIPI_TX0_D0_P
MIPI_TX0_D1_N: J4.166(MIPI_TX0_D1N) ; off-sheet MIPI_TX0_D1_N
MIPI_TX0_D1_P: J4.168(MIPI_TX0_D1P) ; off-sheet MIPI_TX0_D1_P
MIPI_TX0_D2_N: J4.154(MIPI_TX0_D2N) ; off-sheet MIPI_TX0_D2_N
MIPI_TX0_D2_P: J4.156(MIPI_TX0_D2P) ; off-sheet MIPI_TX0_D2_P
MIPI_TX0_D3_N: J4.148(MIPI_TX0_D3N) ; off-sheet MIPI_TX0_D3_N
MIPI_TX0_D3_P: J4.150(MIPI_TX0_D3P) ; off-sheet MIPI_TX0_D3_P
MIPI_TX1/RX1_CLK_N: J4.128(MIPI_TX1/RX1_CLKN) ; off-sheet MIPI_TX1/RX1_CLK_N
MIPI_TX1/RX1_CLK_P: J4.130(MIPI_TX1/RX1_CLKP) ; off-sheet MIPI_TX1/RX1_CLK_P
MIPI_TX1/RX1_D0_N: J4.116(MIPI_TX1/RX1_D0N) ; off-sheet MIPI_TX1/RX1_D0_N
MIPI_TX1/RX1_D0_P: J4.118(MIPI_TX1/RX1_D0P) ; off-sheet MIPI_TX1/RX1_D0_P
MIPI_TX1/RX1_D1_N: J4.122(MIPI_TX1/RX1_D1N) ; off-sheet MIPI_TX1/RX1_D1_N
MIPI_TX1/RX1_D1_P: J4.124(MIPI_TX1/RX1_D1P) ; off-sheet MIPI_TX1/RX1_D1_P
MIPI_TX1/RX1_D2_N: J4.134(MIPI_TX1/RX1_D2N) ; off-sheet MIPI_TX1/RX1_D2_N
MIPI_TX1/RX1_D2_P: J4.136(MIPI_TX1/RX1_D2P) ; off-sheet MIPI_TX1/RX1_D2_P
MIPI_TX1/RX1_D3_N: J4.140(MIPI_TX1/RX1_D3N) ; off-sheet MIPI_TX1/RX1_D3_N
MIPI_TX1/RX1_D3_P: J4.142(MIPI_TX1/RX1_D3P) ; off-sheet MIPI_TX1/RX1_D3_P
PCIE_REF_CLK_N: J4.226(PCIE_REF_CLKN) ; off-sheet PCIE_REF_CLK_N
PCIE_REF_CLK_P: J4.228(PCIE_REF_CLKP) ; off-sheet PCIE_REF_CLK_P
PCIE_RX0_N: J4.214(PCIE_RX0_N) ; off-sheet PCIE_RX0_N
PCIE_RX0_P: J4.216(PCIE_RX0_P) ; off-sheet PCIE_RX0_P
PCIE_RX1_N: J4.202(PCIE_RX1_N) ; off-sheet PCIE_RX1_N
PCIE_RX1_P: J4.204(PCIE_RX1_P) ; off-sheet PCIE_RX1_P
PCIE_RX2_N: J4.190(PCIE_RX2_N) ; off-sheet PCIE_RX2_N
PCIE_RX2_P: J4.192(PCIE_RX2_P) ; off-sheet PCIE_RX2_P
PCIE_RX3_N: J4.178(PCIE_RX3_N) ; off-sheet PCIE_RX3_N
PCIE_RX3_P: J4.180(PCIE_RX3_P) ; off-sheet PCIE_RX3_P
PCIE_TX0_N: J4.220(PCIE_TX0N) ; off-sheet PCIE_TX0_N
PCIE_TX0_P: J4.222(PCIE_TX0P) ; off-sheet PCIE_TX0_P
PCIE_TX1_N: J4.208(PCIE_TX1N) ; off-sheet PCIE_TX1_N
PCIE_TX1_P: J4.210(PCIE_TX1P) ; off-sheet PCIE_TX1_P
PCIE_TX2_N: J4.196(PCIE_TX2N) ; off-sheet PCIE_TX2_N
PCIE_TX2_P: J4.198(PCIE_TX2P) ; off-sheet PCIE_TX2_P
PCIE_TX3_N: J4.184(PCIE_TX3N) ; off-sheet PCIE_TX3_N
PCIE_TX3_P: J4.186(PCIE_TX3P) ; off-sheet PCIE_TX3_P
PWM0_BL: J4.88(PWM0_BL) ; off-sheet PWM0_BL
PWR_KEY: J4.14(PWR_KEY) ; off-sheet PWR_KEY
RECOVERY: J4.20(RECOVERY) ; off-sheet RECOVERY
RESET_IN_H: J4.22(RESET_IN_H) ; off-sheet RESET_IN_H
RTC_BATT_IN: J4.18(RTC_BATT_IN) ; off-sheet RTC_BATT_IN
SDIO0_CLK: J4.112(SDMMC0_CLK) ; off-sheet SDIO0_CLK
SDIO0_CMD: J4.106(SDMMC0_CMD) ; off-sheet SDIO0_CMD
SDIO0_D0: J4.98(SDMMC0_D0) ; off-sheet SDIO0_D0
SDIO0_D1: J4.100(SDMMC0_D1) ; off-sheet SDIO0_D1
SDIO0_D2: J4.102(SDMMC0_D2) ; off-sheet SDIO0_D2
SDIO0_D3: J4.104(SDMMC0_D3) ; off-sheet SDIO0_D3
SDIO0_DETN: J4.108(SDMMC0_DET_L) ; off-sheet SDIO0_DETN
SPI1_CLK: J4.62(SPI1_CLK) ; off-sheet SPI1_CLK
SPI1_CSn0: J4.56(SPI1_CSn0) ; off-sheet SPI1_CSn0
SPI1_RXD/UART4_RX: J4.60(SPI1_RXD/UART4_RX) ; off-sheet SPI1_RXD/UART4_RX
SPI1_TXD/UART4_TX: J4.58(SPI1_TXD/UART4_TX) ; off-sheet SPI1_TXD/UART4_TX
TYPEC1_D_N: J4.177(USB3.0/TYPE-C1_DM) ; off-sheet TYPEC1_D_N
TYPEC1_D_P: J4.175(USB3.0/TYPE-C1_DP) ; off-sheet TYPEC1_D_P
TYPEC1_RX1_N: J4.189(USB3.0/TYPEC1_RX1M) ; off-sheet TYPEC1_RX1_N
TYPEC1_RX1_P: J4.187(USB3.0/TYPEC1_RX1P) ; off-sheet TYPEC1_RX1_P
TYPEC1_RX2_N: J4.201(TYPEC1_RX2M) ; off-sheet TYPEC1_RX2_N
TYPEC1_RX2_P: J4.199(TYPEC1_RX2P) ; off-sheet TYPEC1_RX2_P
TYPEC1_SBU1: J4.205(TYPEC1_SBU1) ; off-sheet TYPEC1_SBU1
TYPEC1_SBU1_DC: J4.211(TYPEC1_SBU1_DC) ; off-sheet TYPEC1_SBU1_DC
TYPEC1_SBU2: J4.207(TYPEC1_SBU2) ; off-sheet TYPEC1_SBU2
TYPEC1_SBU2_DC: J4.213(TYPEC1_SBU2_DC) ; off-sheet TYPEC1_SBU2_DC
TYPEC1_TX1_N: J4.183(USB3.0/TYPEC1_TX1M) ; off-sheet TYPEC1_TX1_N
TYPEC1_TX1_P: J4.181(USB3.0/TYPEC1_TX1P) ; off-sheet TYPEC1_TX1_P
TYPEC1_TX2_N: J4.195(TYPEC1_TX2M) ; off-sheet TYPEC1_TX2_N
TYPEC1_TX2_P: J4.193(TYPEC1_TX2P) ; off-sheet TYPEC1_TX2_P
TYPEC1_U2VBUSDET: J4.215(TYPEC1_U2VBUSDET) ; off-sheet TYPEC1_U2VBUSDET
UART2DBG_RX: J4.54(UART2DBG_RX) ; off-sheet UART2DBG_RX
UART2DBG_TX: J4.52(UART2DBG_TX) ; off-sheet UART2DBG_TX
VDC_ONOFF: J4.16(VDC_OFF_N) ; off-sheet VDC_ONOFF

Not connected (* = marked no-connect by the designer): J4 94(VCC_3V0_SD_OUT)*

### Notes on the sheet
- Title
- Company
- Product Number
- Subtitle
- Project Revision Date
- Template Revision Date
- Project Revision
- Template Revision
- Size
- Page
- A3
- Total
- Checked By
- Drawn By
- 22.07.2025
- Talha ÇETİNCEVİZ
- A

### Library data of the parts
J4 = CON-DIMM_260-SMD: Dimm 260 pin smd plating on pcb; Manufacturer: NA; Manufacturer Part Number: NA; Case/Package: NA; Supplier-1: NA
R94 = RES_10K-0.1W-1%-0402: 10 kOhms ±1% 0.1W, 1/10W Chip Resistor 0402 (1005 Metric) Anti-Sulfur Thin Film; Manufacturer: Vishay Beyschlag/Draloric/BC Components; Manufacturer Part Number: MCS04020C1002FE000; Case/Package: 0402; Supplier-1: Digikey

## Sheet SP1_TYPEC_PWR_IN.SchDoc
size A4; Date: 07.08.2025; CheckedBy: Own Check; CompanyName: No Company; DocumentNumber: ELK.PCB.0005.0005.A.A; Revision: V0.0.1; SheetNumber: 20; SheetTotal: 22
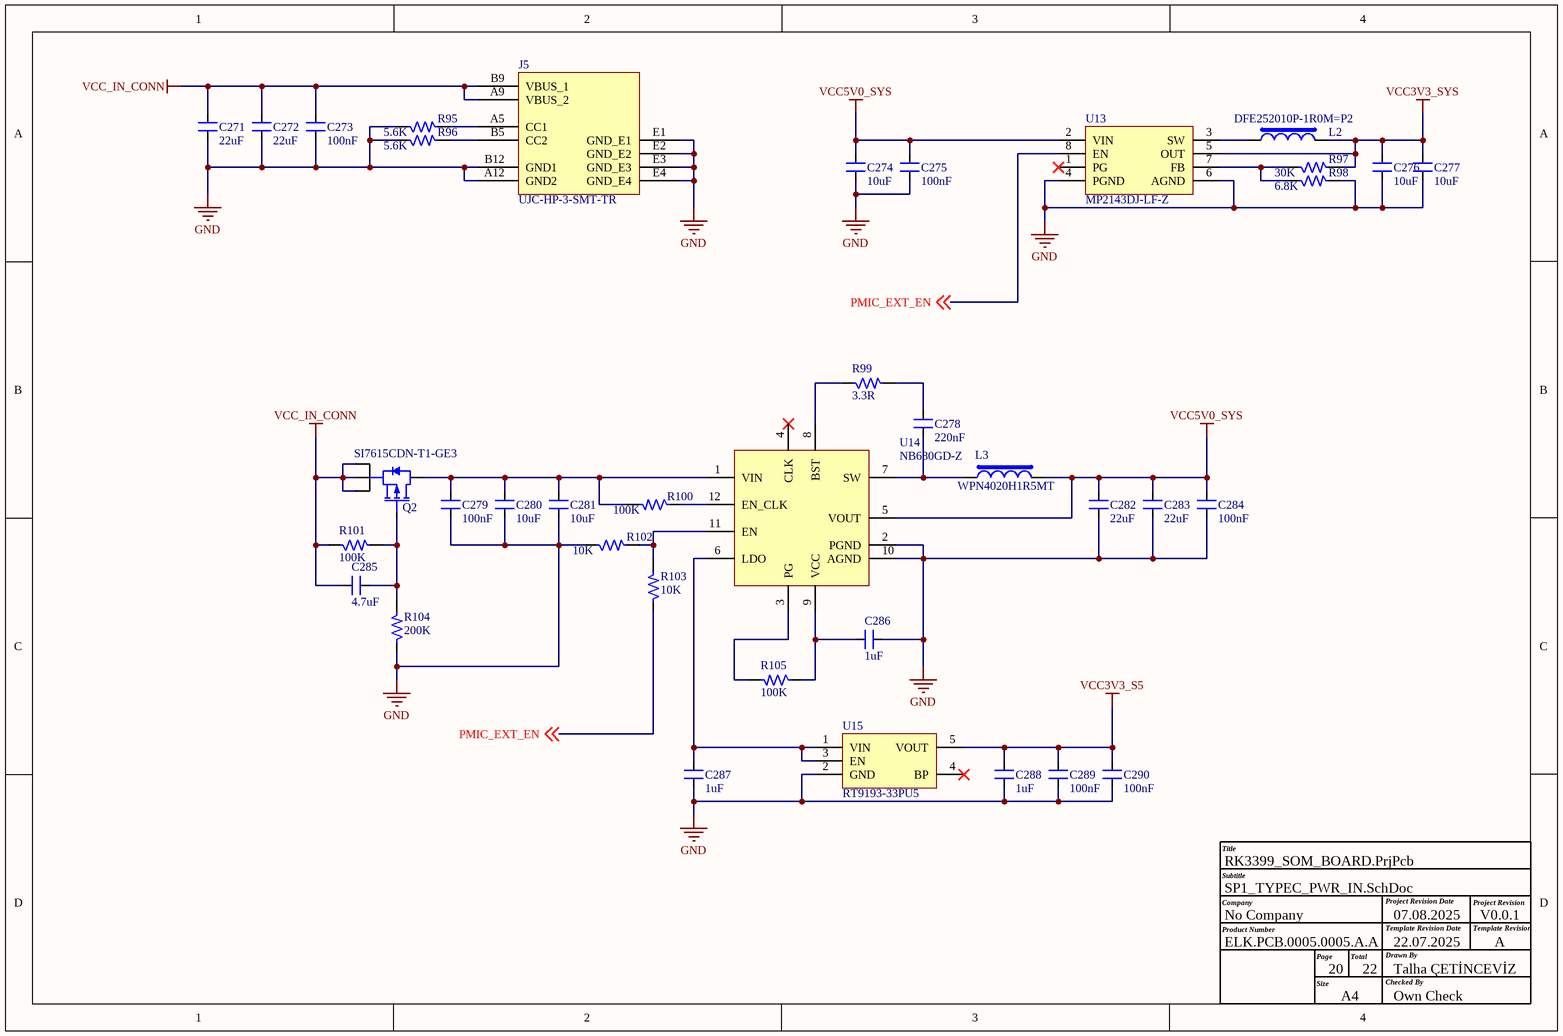
[diagram p18: SP1_TYPEC_PWR_IN.SchDoc]

### Parts
C271  22uF  [CAP_0603]
C272  22uF  [CAP_0603]
C273  100nF  [CAP_0402]
C274  10uF  [CAP_0402]
C275  100nF  [CAP_0402]
C276  10uF  [CAP_0402]
C277  10uF  [CAP_0402]
C278  220nF  [CAP_0402]
C279  100nF  [CAP_0402]
C280  10uF  [CAP_0402]
C281  10uF  [CAP_0402]
C282  22uF  [CAP_0603]
C283  22uF  [CAP_0603]
C284  100nF  [CAP_0402]
C285  4.7uF  [CAP_0402]
C286  1uF  [CAP_0402]
C287  1uF  [CAP_0402]
C288  1uF  [CAP_0402]
C289  100nF  [CAP_0402]
C290  100nF  [CAP_0402]
J5  UJC-HP-3-SMT-TR  [CON6_48.4_UJC-HP-3-SMT-TR]
L2  DFE252010P-1R0M=P2  [IND_1008]
L3  WPN4020H1R5MT  [IND_1616]
Q2  SI7615CDN-T1-GE3  [PowerPAK_1212-8_SMD]
R95  5.6K  [RES_0402]
R96  5.6K  [RES_0402]
R97  30K  [RES_0402]
R98  6.8K  [RES_0402]
R99  3.3R  [RES_0402]
R100  100K  [RES_0402]
R101  100K  [RES_0402]
R102  10K  [RES_0402]
R103  10K  [RES_0402]
R104  200K  [RES_0402]
R105  100K  [RES_0402]
U13  MP2143DJ-LF-Z  [SOT23-8]
U14  NB680GD-Z  [QFN-12_19_118X118_SMD]
U15  RT9193-33PU5  [SC70-5]

### Nets
GND: C271.1 C272.1 C273.1 C274.1 C275.1 C276.1 C277.1 C279.1 C280.1 C281.1 C282.1 C283.1 C284.1 C286.1 C287.1 C288.1 C289.1 C290.1 J5.A12(GND2) J5.B12(GND1) J5.E1(GND_E1) J5.E2(GND_E2) J5.E3(GND_E3) J5.E4(GND_E4) R95.1 R96.1 R98.2 R102.1 R104.1 U13.4(PGND) U13.6(AGND) U14.2(PGND) U14.10(AGND) U15.2(GND)
VCC3V3_S5: C288.2 C289.2 C290.2 U15.5(VOUT)
VCC3V3_SYS: C276.2 C277.2 L2.2 R97.2 U13.5(OUT)
VCC5V0_SYS: C274.2 C275.2 C282.2 C283.2 C284.2 L3.2 U13.2(VIN) U14.5(VOUT)
VCC_IN_CONN: C271.2 C272.2 C273.2 C285.1 J5.A9(VBUS_2) J5.B9(VBUS_1) Q2.1(S) Q2.2(S) Q2.3(S) R101.1
PMIC_EXT_EN: R103.1 U13.8(EN) ; off-sheet PMIC_EXT_EN
NetC278_1: C278.1 L3.1 U14.7(SW)
NetC278_2: C278.2 R99.2
NetC279_2: C279.2 C280.2 C281.2 Q2.5(D) R100.2 U14.1(VIN)
NetC285_2: C285.2 Q2.4(G) R101.2 R104.2
NetC286_2: C286.2 R105.1 U14.9(VCC)
NetC287_2: C287.2 U14.6(LDO) U15.1(VIN) U15.3(EN)
NetJ5_A5: J5.A5(CC1) R95.2
NetJ5_B5: J5.B5(CC2) R96.2
NetL2_1: L2.1 U13.3(SW)
NetR97_1: R97.1 R98.1 U13.7(FB)
NetR99_1: R99.1 U14.8(BST)
NetR100_1: R100.1 U14.12(EN_CLK)
NetR102_2: R102.2 R103.2 U14.11(EN)
NetR105_2: R105.2 U14.3(PG)

Not connected (* = marked no-connect by the designer): U13 1(PG)*; U14 4(CLK)*; U15 4(BP)*

### Notes on the sheet
- Title
- Company
- Product Number
- Subtitle
- Project Revision Date
- Template Revision Date
- Project Revision
- Template Revision
- Size
- Page
- A4
- Total
- Checked By
- Drawn By
- 22.07.2025
- Talha ÇETİNCEVİZ
- A

### Library data of the parts
C271 C272 C282 C283 = CAP_22uF-10V-20%-0603: 22µF ±20% 10V Ceramic Capacitor X5R 0603 (1608 Metric); Manufacturer: Murata Electronics; Manufacturer Part Number: GRM188R61A226ME15D; Case/Package: 0603; Supplier-1: Digikey
C273 C275 C279 C284 C289 C290 = CAP_100nF-25V-10%-0402: 0.1µF ±10% 25V Ceramic Capacitor X7R 0402 (1005 Metric); Manufacturer: Walsin Technology Corporation; Manufacturer Part Number: 0402B104K250CT; Case/Package: 0402; Supplier-1: Digikey
C274 C276 C277 C280 C281 = CAP_10uF-10V-20%-0402: 10µF ±20% 10V Ceramic Capacitor X5R 0402 (1005 Metric); Manufacturer Part Number: CL05A106MP5NUNC; Manufacturer: Samsung Electro-Mechanics; Case/Package: 0402; Supplier-1: Digikey
C278 = CAP_220nF-10V-10%-0402: 0.22µF ±10% 10V Ceramic Capacitor X7R 0402 (1005 Metric); Manufacturer: Samsung Electro-Mechanics; Manufacturer Part Number: CL05B224KP5NNNC; Case/Package: 0402; Supplier-1: Digikey
C285 = CAP_4.7uF-10V-10%-0402: 4.7µF ±10% 10V Ceramic Capacitor X5R 0402 (1005 Metric); Manufacturer: Samsung Electro-Mechanics; Manufacturer Part Number: CL05A475KP5NRNC; Case/Package: 0402; Supplier-1: Digikey
C286-C288 = CAP_1uF-16V-10%-0402: 1µF ±10% 16V Ceramic Capacitor X5R 0402 (1005 Metric); Manufacturer: Knowles Novacap; Manufacturer Part Number: 0402BW105K160YT; Case/Package: 0402; Supplier-1: Digikey
J5 = CON-TYPEC_6X1-100-RA-TH: USB Connectors USB jack, C type, power only, 6 pin, horizonal, gold flash plating, surface mount, T&R; Manufacturer: CUI Devices; Manufacturer Part Number: UJC-HP-3-SMT-TR; Case/Package: TH; Supplier-1: Mouser
L2 = IND_1uH-3.8A-20%-1008: 1µH Shielded Wirewound Inductor 3.8A 54mOhm Max 1008 (2520 Metric); Manufacturer: Murata Electronics; Manufacturer Part Number: DFE252010P-1R0M=P2; Case/Package: 1008; Supplier-1: Digikey
L3 = IND_1.5uH-6A-20%-SMD: Wire Wound SMD Power Inductors – WPN Series / Operating Temp. : -40℃~+125℃ (Including self-heating); Manufacturer: Sunlord; Mnaufcaturer Part Number: WPN4020H1R5MT; Case/Package: SMD; Supplier-1: NA
Q2 = MOSFET-P_20V-35A-1212-8: P-Channel 20V 35A (Tc) 33W (Tc) Surface Mount PowerPAK® 1212-8; Manufacturer: Vishay Siliconix; Manufacturer Part Number: SI7615CDN-T1-GE3; Case/Package: PowerPAK® 1212-8; Supplier-1: Digikey
R95 R96 = RES_5.6K-0.1W-1%-0402: 5.6 kOhms ±1% 0.1W, 1/10W Chip Resistor 0402 (1005 Metric) Automotive AEC-Q200, Moisture Resistant Thick Film; Manufacturer: KOA Speer Electronics, Inc.; Manufacturer Part Number: RK73H1ETTP5601F; Case/Package: 0402; Supplier-1: Digikey
R97 = RES_30K-0.1W-1%-0402: 30 kOhms ±1% 0.1W, 1/10W Chip Resistor 0402 (1005 Metric) Automotive AEC-Q200, Moisture Resistant Thick Film; Manufacturer: KOA Speer Electronics, Inc.; Manufacturer Part Number: RK73H1ETTP3002F; Case/Package: 0402; Supplier-1: Digikey
R98 = RES_6.8K-0.1W-1%-0402: 6.8 kOhms ±1% 0.1W, 1/10W Chip Resistor 0402 (1005 Metric) Anti-Sulfur Thin Film; Manufacturer: Vishay Beyschlag/Draloric/BC Components; Manufacturer Part Number: MCS04020C6801FE000; Supplier-1: Digikey; Case/Package: 0402
R99 = RES_3.3R-0.1W-1%-0402: 3.3 Ohms ±1% 0.1W, 1/10W Chip Resistor 0402 (1005 Metric) Anti-Sulfur, Automotive AEC-Q200 Thick Film; Manufacturer: Panasonic Electronic Components; Manufacturer Part Number: ERJ-U02F3R30X; Case/Package: 0402; Supplier-1: Digikey
R100 R101 R105 = RES_100K-0.1W-1%-0402: 100 kOhms ±1% 0.1W, 1/10W Chip Resistor 0402 (1005 Metric) Anti-Sulfur Thin Film; Manufacturer: Vishay Beyschlag/Draloric/BC Components; Manufacturer Part Number: MCS04020C1003FE000; Case/Package: 0402; Supplier-1: Digikey
R102 R103 = RES_10K-0.1W-1%-0402: as R94 on sheet DDR4_260PIN_Connector; Case/Package: 0402; Supplier-1: Digikey
R104 = RES_200K-0.1W-1%-0402: 200 kOhms ±1% 0.1W, 1/10W Chip Resistor 0402 (1005 Metric) Automotive AEC-Q200 Thick Film; Manufacturer: Panasonic Electronic Components; Manufacturer Part number: ERJ-2RKF2003X; Case/Package: 0402; Supplier-1: Digikey
U13 = REG_0.6~5V-5.5V-3A-TSOT-23-8: Switching Voltage Regulators 3A, 5.5V, 1.2MHz Sync Stp-Dwn Swtchr; Manufacturer: Monolithic Power Systems (MPS); Manufacturer Part Number: MP2143DJ-LF-Z; Case/Package: TSOT-23-8; Supplier-1: Mouser
U14 = REG_3.3V-26V-8A-QFN-12: Switching Voltage Regulators 26V Fixed 3.3 V-8A Sync Buck Converter; Manufacturer: Monolithic Power Systems (MPS); Manufacturer Part Number: NB680GD-Z; Case/Package: QFN-12; Supplier-1: Mouser
U15 = REG_3.3V-5.5V-300mA-SC-70-5: SC-70-5 Dropout Regulators(LDO) RoHS; Manufacturer: Richtek Tech; Manufacturer Part Number: RT9193-33PU5; Case/Package: SC-70-5; Supplier-1: LCSC

## Sheet SP2_BUCKs_GPU_LOG_CPU-B.SchDoc
size A3; Date: 07.08.2025; CheckedBy: Own Check; CompanyName: No Company; DocumentNumber: ELK.PCB.0005.0005.A.A; Revision: V0.0.1; SheetNumber: 21; SheetTotal: 22
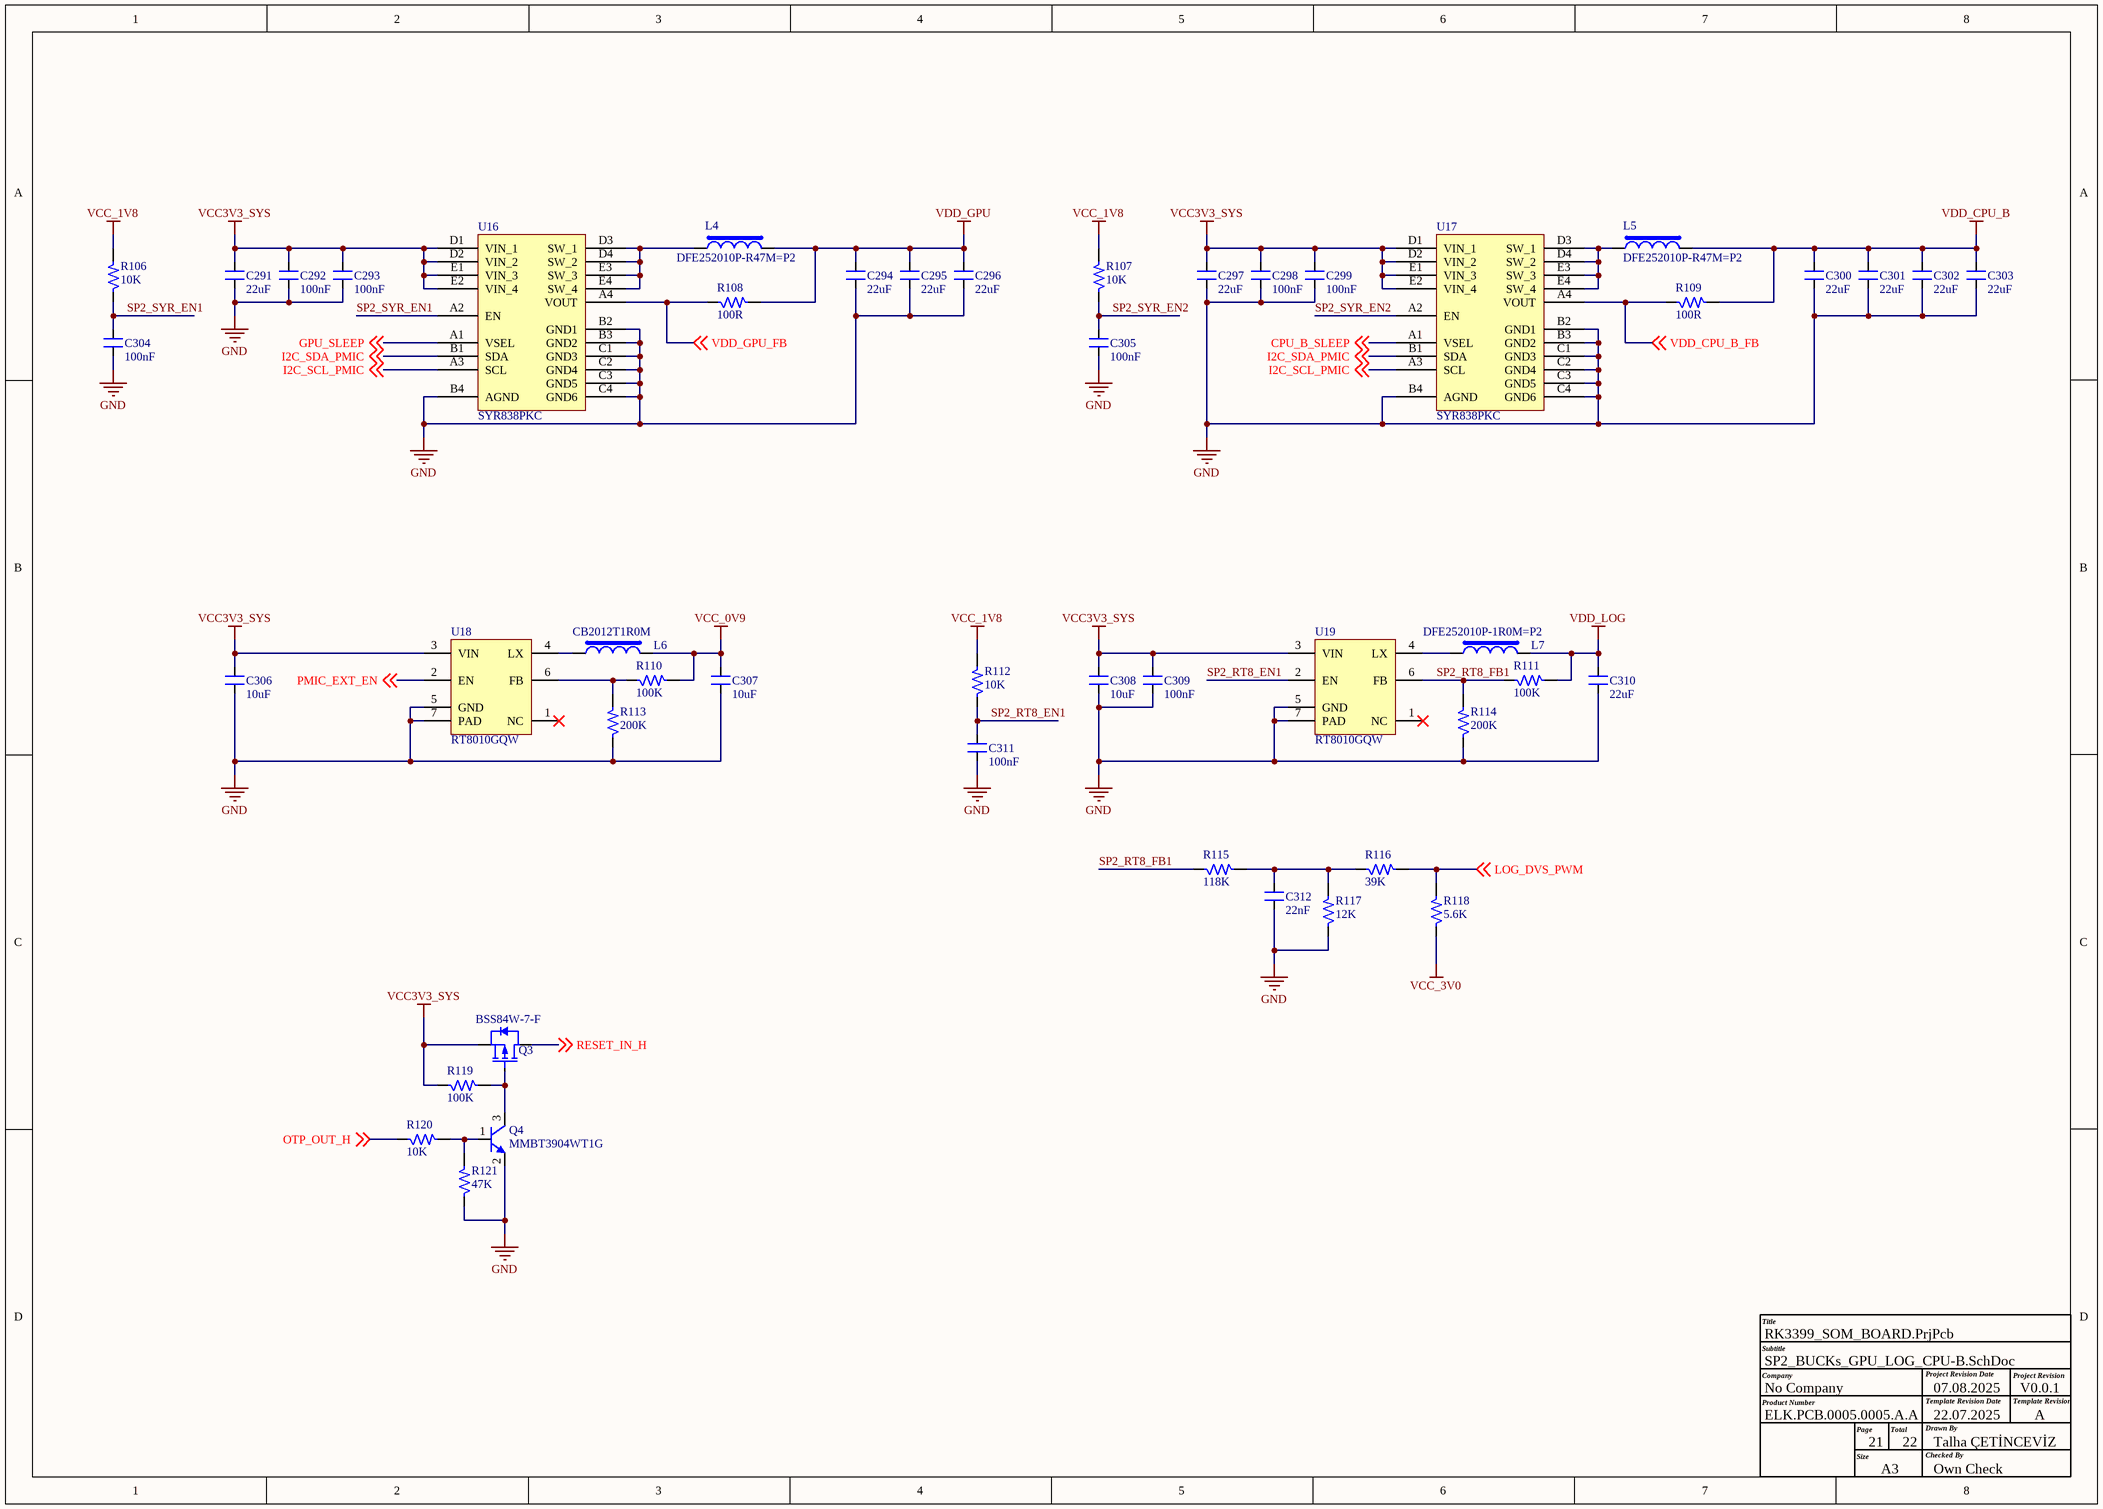
[diagram p19: SP2_BUCKs_GPU_LOG_CPU-B.SchDoc]

### Parts
C291  22uF  [CAP_0603]
C292  100nF  [CAP_0402]
C293  100nF  [CAP_0402]
C294  22uF  [CAP_0603]
C295  22uF  [CAP_0603]
C296  22uF  [CAP_0603]
C297  22uF  [CAP_0603]
C298  100nF  [CAP_0402]
C299  100nF  [CAP_0402]
C300  22uF  [CAP_0603]
C301  22uF  [CAP_0603]
C302  22uF  [CAP_0603]
C303  22uF  [CAP_0603]
C304  100nF  [CAP_0402]
C305  100nF  [CAP_0402]
C306  10uF  [CAP_0402]
C307  10uF  [CAP_0402]
C308  10uF  [CAP_0402]
C309  100nF  [CAP_0402]
C310  22uF  [CAP_0603]
C311  100nF  [CAP_0402]
C312  22nF  [CAP_0402]
L4  DFE252010P-R47M=P2  [IND_1008]
L5  DFE252010P-R47M=P2  [IND_1008]
L6  CB2012T1R0M  [IND_0805]
L7  DFE252010P-1R0M=P2  [IND_1008]
Q3  BSS84W-7-F  [SOT-323-3]
Q4  MMBT3904WT1G  [SOT-323-3]
R106  10K  [RES_0402]
R107  10K  [RES_0402]
R108  100R  [RES_0402]
R109  100R  [RES_0402]
R110  100K  [RES_0402]
R111  100K  [RES_0402]
R112  10K  [RES_0402]
R113  200K  [RES_0402]
R114  200K  [RES_0402]
R115  118K  [RES_0402]
R116  39K  [RES_0402]
R117  12K  [RES_0402]
R118  5.6K  [RES_0402]
R119  100K  [RES_0402]
R120  10K  [RES_0402]
R121  47K  [RES_0402]
U16  SYR838PKC  [CSP20_15.7_100x84_SMD]
U17  SYR838PKC  [CSP20_15.7_100x84_SMD]
U18  RT8010GQW  [WDFN-6_26_133X100_SMD]
U19  RT8010GQW  [WDFN-6_26_133X100_SMD]

### Nets
GND: C291.1 C292.1 C293.1 C294.1 C295.1 C296.1 C297.1 C298.1 C299.1 C300.1 C301.1 C302.1 C303.1 C304.1 C305.1 C306.1 C307.1 C308.1 C309.1 C310.1 C311.1 C312.1 Q4.2(E) R113.1 R114.1 R117.1 R121.1 U16.B2(GND1) U16.B3(GND2) U16.B4(AGND) U16.C1(GND3) U16.C2(GND4) U16.C3(GND5) U16.C4(GND6) U17.B2(GND1) U17.B3(GND2) U17.B4(AGND) U17.C1(GND3) U17.C2(GND4) U17.C3(GND5) U17.C4(GND6) U18.5(GND) U18.7(PAD) U19.5(GND) U19.7(PAD)
VCC3V3_SYS: C291.2 C292.2 C293.2 C297.2 C298.2 C299.2 C306.2 C308.2 C309.2 Q3.2(S) R119.1 U16.D1(VIN_1) U16.D2(VIN_2) U16.E1(VIN_3) U16.E2(VIN_4) U17.D1(VIN_1) U17.D2(VIN_2) U17.E1(VIN_3) U17.E2(VIN_4) U18.3(VIN) U19.3(VIN)
VCC_0V9: C307.2 L6.2 R110.2
VCC_1V8: R106.2 R107.2 R112.2
VCC_3V0: R118.1
VDD_CPU_B: C300.2 C301.2 C302.2 C303.2 L5.2 R109.2
VDD_GPU: C294.2 C295.2 C296.2 L4.2 R108.2
VDD_LOG: C310.2 L7.2 R111.2
CPU_B_SLEEP: U17.A1(VSEL) ; off-sheet CPU_B_SLEEP
GPU_SLEEP: U16.A1(VSEL) ; off-sheet GPU_SLEEP
I2C_SCL_PMIC: U16.A3(SCL) U17.A3(SCL) ; off-sheet I2C_SCL_PMIC
I2C_SDA_PMIC: U16.B1(SDA) U17.B1(SDA) ; off-sheet I2C_SDA_PMIC
LOG_DVS_PWM: R116.2 R118.2 ; off-sheet LOG_DVS_PWM
OTP_OUT_H: R120.1 ; off-sheet OTP_OUT_H
PMIC_EXT_EN: U18.2(EN) ; off-sheet PMIC_EXT_EN
RESET_IN_H: Q3.3(D) ; off-sheet RESET_IN_H
SP2_RT8_EN1: C311.2 R112.1 U19.2(EN)
SP2_RT8_FB1: R111.1 R114.2 R115.1 U19.6(FB)
SP2_SYR_EN1: C304.2 R106.1 U16.A2(EN)
SP2_SYR_EN2: C305.2 R107.1 U17.A2(EN)
VDD_CPU_B_FB: R109.1 U17.A4(VOUT) ; off-sheet VDD_CPU_B_FB
VDD_GPU_FB: R108.1 U16.A4(VOUT) ; off-sheet VDD_GPU_FB
NetC312_2: C312.2 R115.2 R116.1 R117.2
NetL4_1: L4.1 U16.D3(SW_1) U16.D4(SW_2) U16.E3(SW_3) U16.E4(SW_4)
NetL5_1: L5.1 U17.D3(SW_1) U17.D4(SW_2) U17.E3(SW_3) U17.E4(SW_4)
NetL6_1: L6.1 U18.4(LX)
NetL7_1: L7.1 U19.4(LX)
NetQ3_1: Q3.1(G) Q4.3(C) R119.2
NetQ4_1: Q4.1(B) R120.2 R121.2
NetR110_1: R110.1 R113.2 U18.6(FB)

Not connected (* = marked no-connect by the designer): U18 1(NC)*; U19 1(NC)*

### Notes on the sheet
- Title
- Company
- Product Number
- Subtitle
- Project Revision Date
- Template Revision Date
- Project Revision
- Template Revision
- Size
- Page
- A3
- Total
- Checked By
- Drawn By
- 22.07.2025
- Talha ÇETİNCEVİZ
- A

### Library data of the parts
C291 C294-C297 C300-C303 C310 = CAP_22uF-10V-20%-0603: as C271 on sheet SP1_TYPEC_PWR_IN; Case/Package: 0603; Supplier-1: Digikey
C292 C293 C298 C299 C304 C305 C309 C311 = CAP_100nF-25V-10%-0402: as C273 on sheet SP1_TYPEC_PWR_IN; Case/Package: 0402; Supplier-1: Digikey
C306-C308 = CAP_10uF-10V-20%-0402: as C274 on sheet SP1_TYPEC_PWR_IN; Case/Package: 0402; Supplier-1: Digikey
C312 = CAP_22nF-10V-10%-0402: 0.022µF ±10% 10V Ceramic Capacitor X7R 0402 (1005 Metric); Manufacturer: Samsung Electro-Mechanics; Manufacturer Part Number: CL05B223KP5NNNC; Case/Package: 0402; Supplier-1: Digikey
L4 L5 = IND_470nH-5A-20%-1008: 470nH Shielded Wirewound Inductor 5A 35mOhm Max 1008 (2520 Metric); Manufacturer: Murata Electronics; Manufacturer Part Number: DFE252010P-R47M=P2; Case/Package: 1008; Supplier-1: Digikey
L6 = IND_1uF-0.5A-20%-0805: 1uH ±20% 500mA 150mΩ 0805 Inductors (SMD) RoHS; Manufacturer: Taiyo Yuden; Manufacturer Part Number: CB2012T1R0M; Case/Package: 0805; Supplier-1: LCSC
L7 = IND_1uH-3.8A-20%-1008: as L2 on sheet SP1_TYPEC_PWR_IN; Manufacturer Part Number: DFE252010P-1R0M=P2; Case/Package: 1008; Supplier-1: Digikey
Q3 = MOSFET-P_50V-130mA-SOT-323: P-Channel 50V 130mA (Ta) 200mW (Ta) Surface Mount SOT-323; Manufacturer: Diodes Incorporated; Manufacturer Part Number: BSS84W-7-F; Case/Package: SOT-323; Supplier-1: Digikey
Q4 = TRNS-NPN_60V-0.2A-SOT323: Bipolar Transistors - BJT 200mA 60V NPN; Manufacturer: ON Semiconductor; Manufacturer Part Number: MMBT3904WT1G; Case/Package: SOT323; Supplier-1: Digikey
R106 R107 R112 R120 = RES_10K-0.1W-1%-0402: as R94 on sheet DDR4_260PIN_Connector; Case/Package: 0402; Supplier-1: Digikey
R108 R109 = RES_100R-0.1W-1%-0402: 100 Ohms ±1% 0.1W, 1/10W Chip Resistor 0402 (1005 Metric) Automotive AEC-Q200, Moisture Resistant Thick Film; Manufacturer: KOA Speer Electronics, Inc.; Manufacturer Part Number: RK73H1ETTP1000F; Case/Package: 0402; Supplier-1: Digikey
R110 R111 R119 = RES_100K-0.1W-1%-0402: as R100 on sheet SP1_TYPEC_PWR_IN; Case/Package: 0402; Supplier-1: Digikey
R113 R114 = RES_200K-0.1W-1%-0402: as R104 on sheet SP1_TYPEC_PWR_IN; Case/Package: 0402; Supplier-1: Digikey
R115 = RES_118K-0.1W-1%-0402: 118 kOhms ±1% 0.1W, 1/10W Chip Resistor 0402 (1005 Metric) Automotive AEC-Q200, Moisture Resistant Thick Film; Manufacturer: KOA Speer Electronics, Inc.; Manuafcturer Part Number: RK73H1ETTP1183F; Case/Package: 0402; Supplier-1: Digikey
R116 = RES_39K-0.1W-1%-0402: 39 kOhms ±1% 0.1W, 1/10W Chip Resistor 0402 (1005 Metric) Automotive AEC-Q200, Moisture Resistant Thick Film; Manufacturer: KOA Speer Electronics, Inc.; Manufacturer Part Number: RK73H1ETTP3902F; Case/Package: 0402; Supplier-1: Digikey
R117 = RES_12K-0.1W-1%-0402: 12 kOhms ±1% 0.1W, 1/10W Chip Resistor 0402 (1005 Metric) Anti-Sulfur Thin Film; Manufacturer: Vishay Beyschlag/Draloric/BC Components; Manufacturer Part Number: MCS04020C1202FE000; Case/Package: 0402; Supplier-1: Digikey
R118 = RES_5.6K-0.1W-1%-0402: as R95 on sheet SP1_TYPEC_PWR_IN; Case/Package: 0402; Supplier-1: Digikey
R121 = RES_47K-0.1W-1%-0402: 47 kOhms ±1% 0.1W, 1/10W Chip Resistor 0402 (1005 Metric) Automotive AEC-Q200 Thick Film; Manufacturer: Panasonic Electronic Components; Manufacturer Part Number: ERJ-2RKF4702X; Case/Package: 0402; Supplier-1: Digikey
U16 U17 = IC_SYR838PKC: Step-Down Positive Programmable 1 6A 2.4MHz CSP1.56*1.96-20 DC-DC Converters RoHS; Manufacturer: Silergy Corp; Manufacturer Part Number: SYR838PKC; Case/Package: CSP1.56*1.96-20; Supplier-1: LCSC
U18 U19 = REG-ADJ_5.5V-5.5V-1A-6-WDFN: Buck Switching Regulator IC Positive Adjustable 0.6V 1 Output 1A 6-WDFN Exposed Pad; Manufacturer: Richtek USA Inc.; Manufacturer Part Number: RT8010GQW; Case/Package: 6-WDFN; Supplier-1: Digikey